# EAGLE design Z80-4chip7 (EAGLE 7.6.0)

## Sheet 1 of 3
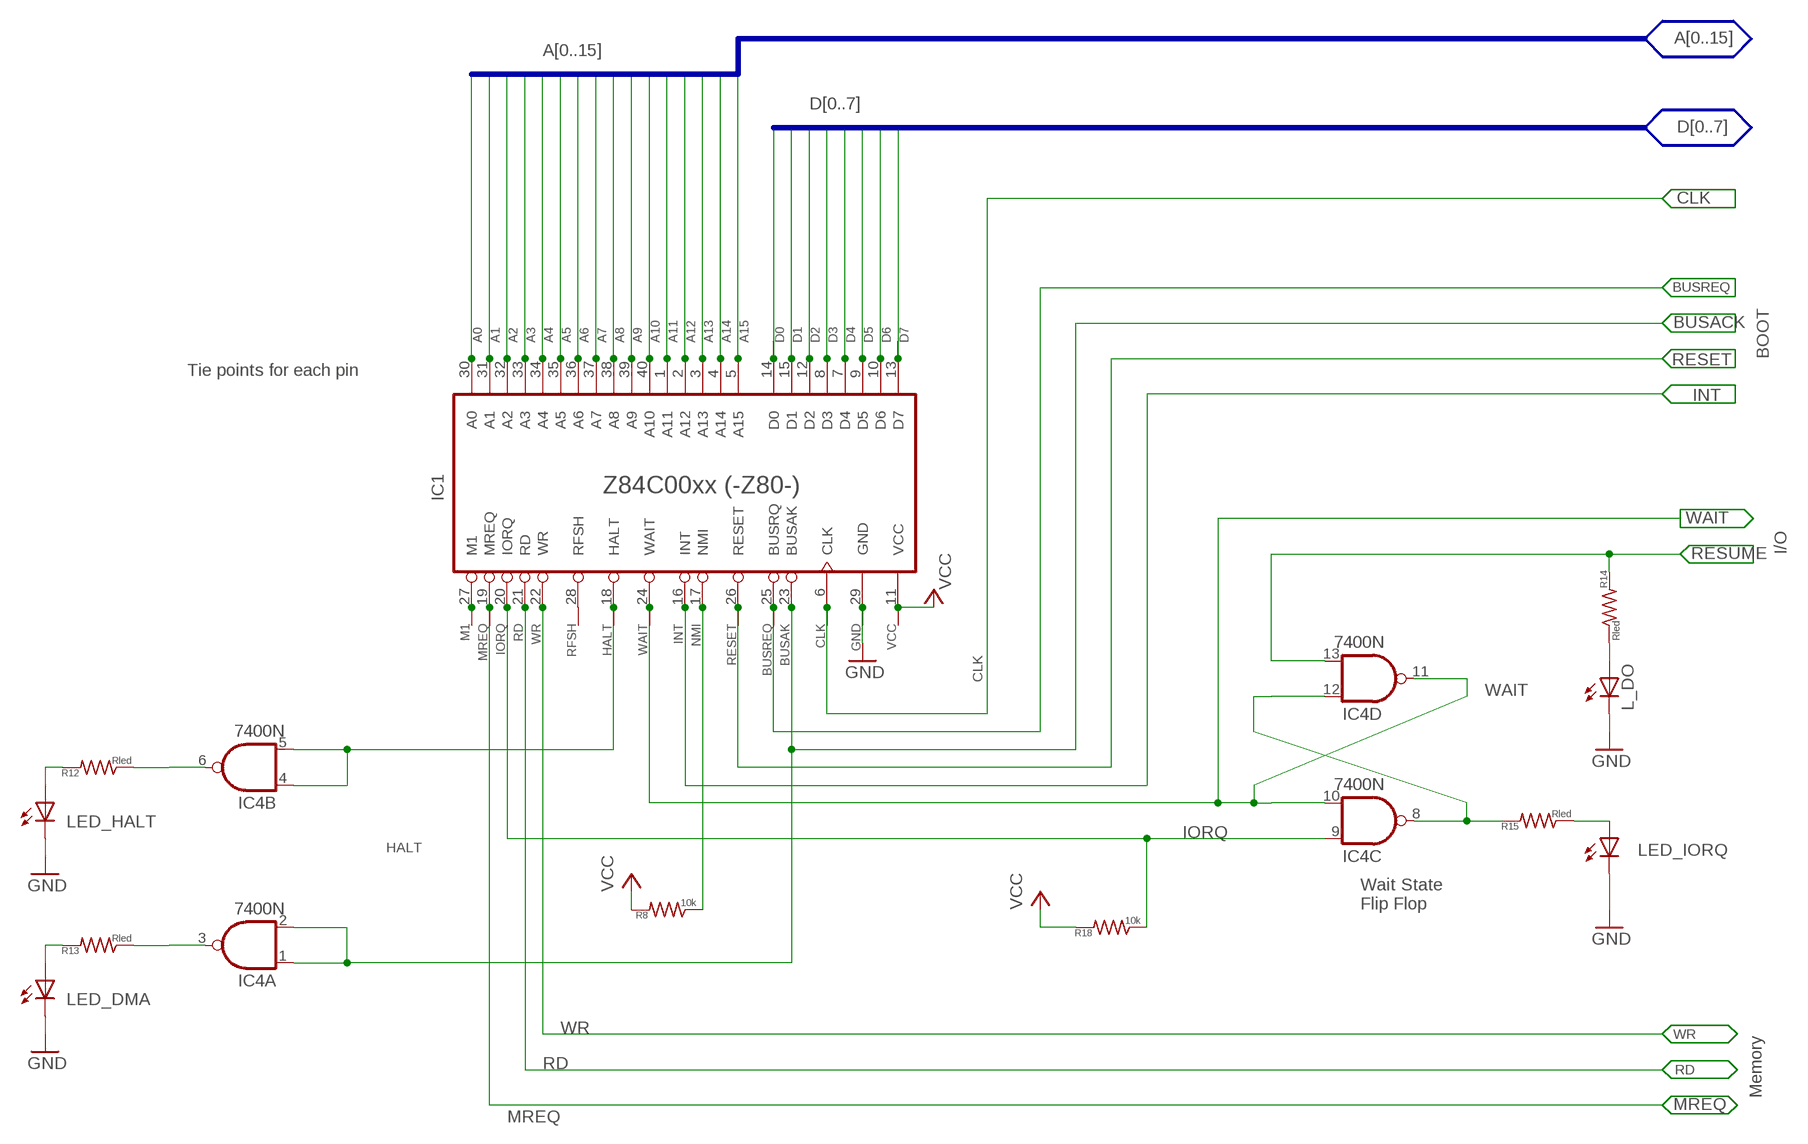
[diagram p0: schematic, sheet 1]

### Parts
A0  WIRE-VIA8  [VIA8]
A1  WIRE-VIA8  [VIA8]
A2  WIRE-VIA8  [VIA8]
A3  WIRE-VIA8  [VIA8]
A4  WIRE-VIA8  [VIA8]
A5  WIRE-VIA8  [VIA8]
A6  WIRE-VIA8  [VIA8]
A7  WIRE-VIA8  [VIA8]
A8  WIRE-VIA8  [VIA8]
A9  WIRE-VIA8  [VIA8]
A10  WIRE-VIA8  [VIA8]
A11  WIRE-VIA8  [VIA8]
A12  WIRE-VIA8  [VIA8]
A13  WIRE-VIA8  [VIA8]
A14  WIRE-VIA8  [VIA8]
A15  WIRE-VIA8  [VIA8]
BUSAK  WIRE-VIA8  [VIA8]
BUSREQ  WIRE-VIA8  [VIA8]
CLK  WIRE-VIA8  [VIA8]
D0  WIRE-VIA8  [VIA8]
D1  WIRE-VIA8  [VIA8]
D2  WIRE-VIA8  [VIA8]
D3  WIRE-VIA8  [VIA8]
D4  WIRE-VIA8  [VIA8]
D5  WIRE-VIA8  [VIA8]
D6  WIRE-VIA8  [VIA8]
D7  WIRE-VIA8  [VIA8]
GND  WIRE-VIA8  [VIA8]
HALT  WIRE-VIA8  [VIA8]
IC1  Z84C00xx (-Z80-)  Z80CPU  [DIL40]
IC4  7400N  [DIL14]
INT  WIRE-VIA8  [VIA8]
IORQ  WIRE-VIA8  [VIA8]
L_DO  LED3MM  [LED3MM]
LED_DMA  LED3MM  [LED3MM]
LED_HALT  LED3MM  [LED3MM]
LED_IORQ  LED3MM  [LED3MM]
M1  WIRE-VIA8  [VIA8]
MREQ  WIRE-VIA8  [VIA8]
NMI  WIRE-VIA8  [VIA8]
R8  10k  R-US_0207/07V  [0204/5]
R12  Rled  R-US_0207/07V  [0204/5]
R13  Rled  R-US_0207/07V  [0204/5]
R14  Rled  R-US_0207/07V  [0204/5]
R15  Rled  R-US_0207/07V  [0204/5]
R18  10k  R-US_0207/07V  [0204/5]
RD  WIRE-VIA8  [VIA8]
RESET  WIRE-VIA8  [VIA8]
RFSH  WIRE-VIA8  [VIA8]
VCC  WIRE-VIA8  [VIA8]
WAIT  WIRE-VIA8  [VIA8]
WR  WIRE-VIA8  [VIA8]

### Nets
A0: A0.P$1 IC1.30(A0) ; also sheet 2
A1: A1.P$1 IC1.31(A1) ; also sheet 2
A2: A2.P$1 IC1.32(A2) ; also sheet 2
A3: A3.P$1 IC1.33(A3) ; also sheet 2
A4: A4.P$1 IC1.34(A4) ; also sheet 2
A5: A5.P$1 IC1.35(A5) ; also sheet 2
A6: A6.P$1 IC1.36(A6) ; also sheet 2
A7: A7.P$1 IC1.37(A7) ; also sheet 2
A8: A8.P$1 IC1.38(A8) ; also sheet 2
A9: A9.P$1 IC1.39(A9) ; also sheet 2
A10: A10.P$1 IC1.40(A10) ; also sheet 2
A11: A11.P$1 IC1.1(A11) ; also sheet 2
A12: A12.P$1 IC1.2(A12) ; also sheet 2
A13: A13.P$1 IC1.3(A13) ; also sheet 2
A14: A14.P$1 IC1.4(A14) ; also sheet 2
A15: A15.P$1 IC1.5(A15) ; also sheet 2
BUSACK: BUSAK.P$1 IC1.23(BUSAK) IC4.1(A:I0) IC4.2(A:I1) ; also sheet 2
BUSREQ: BUSREQ.P$1 IC1.25(BUSRQ) ; also sheet 2
CLK: CLK.P$1 IC1.6(CLK) ; also sheet 2
D0: D0.P$1 IC1.14(D0) ; also sheet 2
D1: D1.P$1 IC1.15(D1) ; also sheet 2
D2: D2.P$1 IC1.12(D2) ; also sheet 2
D3: D3.P$1 IC1.8(D3) ; also sheet 2
D4: D4.P$1 IC1.7(D4) ; also sheet 2
D5: D5.P$1 IC1.9(D5) ; also sheet 2
D6: D6.P$1 IC1.10(D6) ; also sheet 2
D7: D7.P$1 IC1.13(D7) ; also sheet 2
GND [power]: GND.P$1 IC1.29(GND) L_DO.K(C) LED_DMA.K(C) LED_HALT.K(C) LED_IORQ.K(C) ; also sheet 2,3
HALT: HALT.P$1 IC1.18(HALT) IC4.4(B:I0) IC4.5(B:I1)
INT: IC1.16(INT) INT.P$1 ; also sheet 2
IORQ: IC1.20(IORQ) IC4.9(C:I0) IORQ.P$1 R18.1
MREQ: IC1.19(MREQ) MREQ.P$1 ; also sheet 2
N$1: IC1.27(M1) M1.P$1
N$2: IC4.6(B:O) R12.1
N$3: IC4.3(A:O) R13.1
N$5: LED_HALT.A R12.2
N$6: LED_DMA.A R13.2
N$7: L_DO.A R14.1
N$8: LED_IORQ.A R15.1
N$10: IC1.28(RFSH) RFSH.P$1
N$17: IC4.8(C:O) IC4.12(D:I0) R15.2
NMI: IC1.17(NMI) NMI.P$1 R8.1
RD: IC1.21(RD) RD.P$1 ; also sheet 2
RESET: IC1.26(RESET) RESET.P$1 ; also sheet 2
RESUME: IC4.13(D:I1) R14.2 ; also sheet 2
VCC [power]: IC1.11(VCC) R8.2 R18.2 VCC.P$1 ; also sheet 2,3
WAIT: IC1.24(WAIT) IC4.10(C:I1) IC4.11(D:O) WAIT.P$1 ; also sheet 2
WR: IC1.22(WR) WR.P$1 ; also sheet 2

### Buses
A[0..15]
D[0..7]

### Notes on the sheet
- BOOT
- Tie points for each pin
- I/O
- Wait State
  Flip Flop
- Memory

## Sheet 2 of 3
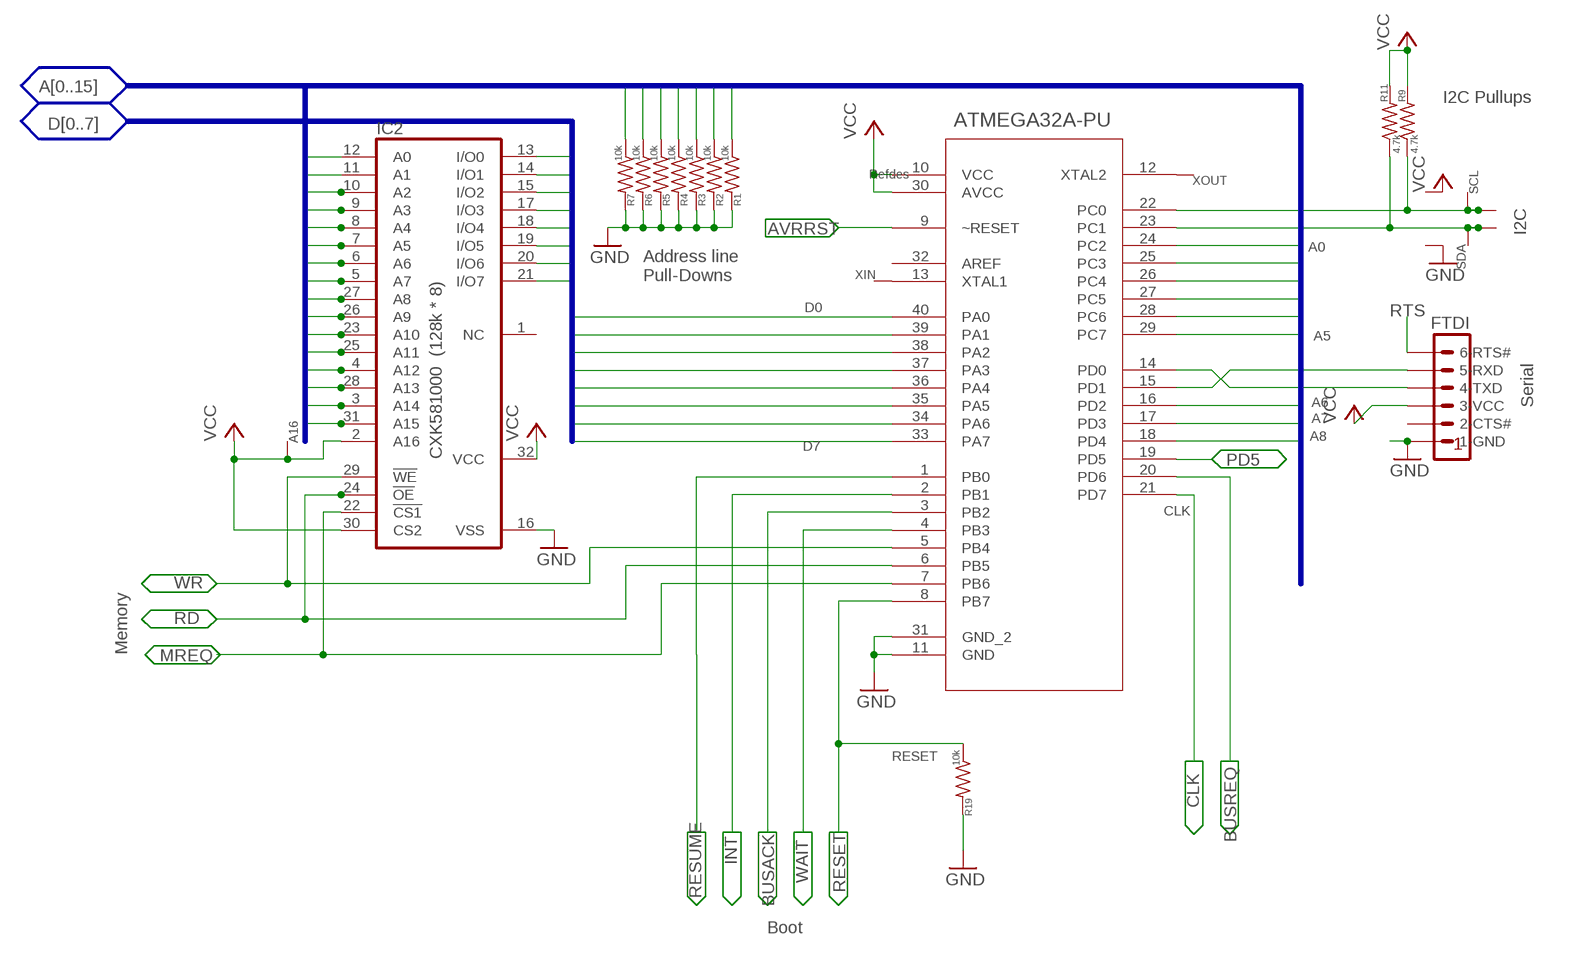
[diagram p1: schematic, sheet 2]

### Parts
A16  WIRE-VIA8  [VIA8]
FTDI  FTDI-TTL232R  [MA06-1]
I2CG  WIRE-R10  [VIA10]
I2CV  WIRE-R10  [VIA10]
IC2  CXK581000 (128k * 8)  MEM128K-PS  [DIL32]
R1  10k  R-US_0207/07V  [0204/5]
R2  10k  R-US_0207/07V  [0204/5]
R3  10k  R-US_0207/07V  [0204/5]
R4  10k  R-US_0207/07V  [0204/5]
R5  10k  R-US_0207/07V  [0204/5]
R6  10k  R-US_0207/07V  [0204/5]
R7  10k  R-US_0207/07V  [0204/5]
R9  4.7k  R-US_0207/07V  [0204/5]
R11  4.7k  R-US_0207/07V  [0204/5]
R19  10k  R-US_0207/07V  [0204/5]
SCL  WIRE-R10  [VIA10]
SDA  WIRE-R10  [VIA10]
U1  ATMEGA32A-PU  [DIP254P1524X482-40]
W1  WIRE-VIA8  [VIA8]
W2  WIRE-VIA8  [VIA8]
XIN  WIRE-VIA8  [VIA8]
XOUT  WIRE-VIA8  [VIA8]

### Nets
A0: IC2.12(A0) U1.24(PC2) ; also sheet 1
A1: IC2.11(A1) U1.25(PC3) ; also sheet 1
A2: IC2.10(A2) U1.26(PC4) ; also sheet 1
A3: IC2.9(A3) U1.27(PC5) ; also sheet 1
A4: IC2.8(A4) U1.28(PC6) ; also sheet 1
A5: IC2.7(A5) U1.29(PC7) ; also sheet 1
A6: IC2.6(A6) U1.16(PD2) ; also sheet 1
A7: IC2.5(A7) U1.17(PD3) ; also sheet 1
A8: IC2.27(A8) U1.18(PD4) ; also sheet 1
A9: IC2.26(A9) R1.1 ; also sheet 1
A10: IC2.23(A10) R2.1 ; also sheet 1
A11: IC2.25(A11) R3.1 ; also sheet 1
A12: IC2.4(A12) R4.1 ; also sheet 1
A13: IC2.28(A13) R5.1 ; also sheet 1
A14: IC2.3(A14) R6.1 ; also sheet 1
A15: IC2.31(A15) R7.1 ; also sheet 1
AVRRST: U1.9(~RESET) ; also sheet 3
BUSACK: U1.3(PB2) ; also sheet 1
BUSREQ: U1.20(PD6) ; also sheet 1
CLK: U1.21(PD7) ; also sheet 1
D0: IC2.13(I/O0) U1.40(PA0) ; also sheet 1
D1: IC2.14(I/O1) U1.39(PA1) ; also sheet 1
D2: IC2.15(I/O2) U1.38(PA2) ; also sheet 1
D3: IC2.17(I/O3) U1.37(PA3) ; also sheet 1
D4: IC2.18(I/O4) U1.36(PA4) ; also sheet 1
D5: IC2.19(I/O5) U1.35(PA5) ; also sheet 1
D6: IC2.20(I/O6) U1.34(PA6) ; also sheet 1
D7: IC2.21(I/O7) U1.33(PA7) ; also sheet 1
GND [power]: FTDI.1(1-GND) I2CG.P$1 IC2.16(VSS) R1.2 R2.2 R3.2 R4.2 R5.2 R6.2 R7.2 R19.2 U1.11(GND) U1.31(GND_2) ; also sheet 1,3
INT: U1.2(PB1) ; also sheet 1
MREQ: IC2.22(!CS1) U1.7(PB6) ; also sheet 1
N$4: FTDI.5(5-RXD) U1.15(PD1)
N$11: FTDI.4(4-TXD) U1.14(PD0)
N$110: U1.13(XTAL1) XIN.P$1
N$111: U1.12(XTAL2) XOUT.P$1
PD5: U1.19(PD5) ; also sheet 3
RD: IC2.24(!OE) U1.6(PB5) ; also sheet 1
RESET: R19.1 U1.8(PB7) ; also sheet 1
RESUME: U1.1(PB0) ; also sheet 1
RTS: FTDI.6(6-RTS#) ; also sheet 3
SCL: R9.1 SCL.P$1 U1.22(PC0) W1.P$1
SDA: R11.1 SDA.P$1 U1.23(PC1) W2.P$1
VCC [power]: A16.P$1 FTDI.3(3-VCC) I2CV.P$1 IC2.2(A16) IC2.30(CS2) IC2.32(VCC) R9.2 R11.2 U1.10(VCC) U1.30(AVCC) ; also sheet 1,3
WAIT: U1.4(PB3) ; also sheet 1
WR: IC2.29(!WE) U1.5(PB4) ; also sheet 1
Unconnected: FTDI.2(2-CTS#) IC2.1(NC) U1.32(AREF)

### Buses
A[0..15]
D[0..7]

### Notes on the sheet
- I2C Pullups
- I2C
- Address line
  Pull-Downs
- Serial
- Memory
- Boot

## Sheet 3 of 3
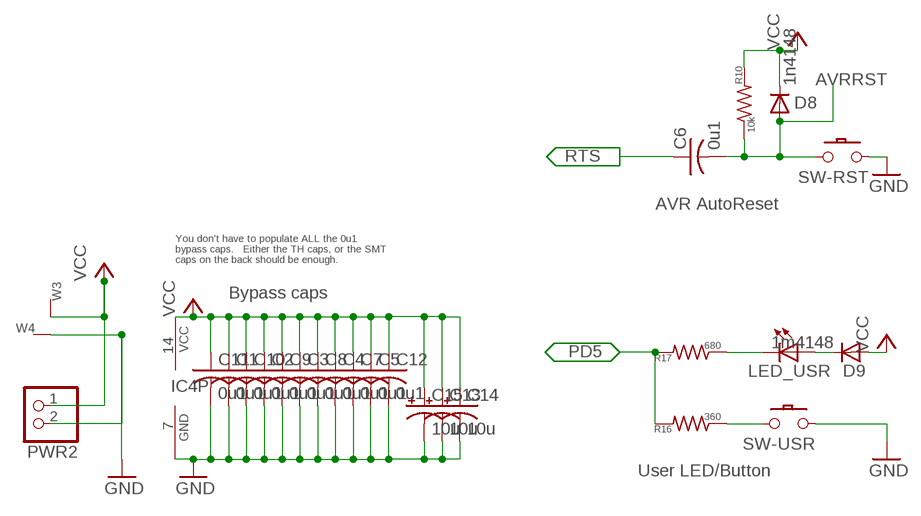
[diagram p2: schematic, sheet 3]

### Parts
C1  0u1  C-US-5MM  [C050-024X044]
C2  0u1  C-US-5MM  [C050-024X044]
C3  0u1  C-US-5MM  [C050-024X044]
C4  0u1  C-US-5MM  [C050-024X044]
C5  0u1  C-US-5MM  [C050-024X044]
C6  0u1  C-US-5MM  [C050-024X044]
C7  0u1  C-US-5MM  [C050-024X044]
C8  0u1  C-USC1206  [C1206]
C9  0u1  C-USC1206  [C1206]
C10  0u1  C-USC1206  [C1206]
C11  0u1  C-USC1206  [C1206]
C12  0u1  C-USC1206  [C1206]
C13  10u  CPOL-USE2.5-6  [E2,5-6]
C14  10u  CPOL-USE2.5-6  [E2,5-6]
C15  10u  CPOL-USE2.5-6  [E2,5-6]
D8  1n4148  DIODE-SIGNAL-5  [DO35-5]
D9  1m4148  DIODE-SIGNAL-5  [DO35-5]
LED_USR  LED3MM  [LED3MM]
PWR2  JST_2PIN-THM  [JST-PH-2-THM]
R10  10k  R-US_0207/07V  [0204/5]
R16  360  R-US_0207/07V  [0204/5]
R17  680  R-US_0207/07V  [0204/5]
SW-RST  SW-PB2/  [SW-PB]
SW-USR  SW-PB2L  [SW-PB]
W3  WIRE-R10  [VIA10]
W4  WIRE-R10  [VIA10]

### Nets
AVRRST: C6.2 D8.A R10.1 SW-RST.3 ; also sheet 2
GND [power]: C1.2 C2.2 C3.2 C4.2 C5.2 C7.2 C8.2 C9.2 C10.2 C11.2 C12.2 C13.- C14.- C15.- IC4.7(P:GND) PWR2.2 SW-RST.2 SW-USR.2 W4.P$1 ; also sheet 1,2
N$15: LED_USR.K(C) R17.1
N$16: D9.C LED_USR.A
N$18: R16.1 SW-USR.4
PD5: R16.2 R17.2 ; also sheet 2
RTS: C6.1 ; also sheet 2
VCC [power]: C1.1 C2.1 C3.1 C4.1 C5.1 C7.1 C8.1 C9.1 C10.1 C11.1 C12.1 C13.+ C14.+ C15.+ D8.C D9.A IC4.14(P:VCC) PWR2.1 R10.2 W3.P$1 ; also sheet 1,2

### Notes on the sheet
- AVR AutoReset
- You don't have to populate ALL the 0u1
  bypass caps.   Either the TH caps, or the SMT
  caps on the back should be enough.
- Bypass caps
- User LED/Button

## Power pins joined to a net without a drawn wire
GND: SW-RST.5(GND) SW-USR.5(GND)

## Library data of the parts
A0 A1-A16 BUSAK BUSREQ CLK D0 D1-D7 GND HALT I2CG I2CV INT IORQ M1 MREQ NMI RD RESET RFSH SCL SDA VCC W1-W4 WAIT WR XIN XOUT = mylib4:WIRE: Pad for a wire offboard
C1-C12 = my-rcl:C-US: CAPACITOR, American symbol
C13-C15 = my-rcl:CPOL-US: POLARIZED CAPACITOR, American symbol
D8 D9 = mylib4:DIODE-SIGNAL
FTDI = mylib4:FTDI-TTL232R: FTDI USB to serial (TTL level) cable
IC1 = zilog:Z80CPU: Z80 FAMILY DEVICE
IC2 = mylib4:MEM128K-PS: MEMORY; OC_FARNELL: unknown; OC_NEWARK: unknown
IC4 = mylib4:74*00: Quad 2-input NAND gate
L_DO LED_DMA LED_HALT LED_IORQ LED_USR = my-led:LED: LED OSRAM: - CHIPLED LG R971, LG N971, LY N971, LG Q971, LY Q971, LO R971, LY R971 LH N974, LH R974 LS Q976, LO Q976, LY Q976 LO Q996 - Hyper CHIPLED LW Q18S LB Q993, LB Q99A, LB R99A - SideLED LS A670, LO A670, LY A670, LG A670, LP A670 LB A673, LV A673, LT A673, LW A673 LH A674 LY A675 LS A676, LA A676, LO A676, LY A676, LW A676 LS A679, LY A679, LG A679 - Hyper Micro SIDELED® LS Y876, LA Y876, LO Y876, LY Y876 LT Y87S - SmartLED LW L88C, LW L88S LB L89C, LB L89S, LG L890 LS L89K, LO L89K, LY L89K LS L896, LA L896, LO L896, LY L896 - TOPLED LS T670, LO T670, LY T670, LG T670, LP T670 LSG T670, LSP T670, LSY T670, LOP T670, LYG T670 LG T671, LOG T671, LSG T671 LB T673, LV T673, LT T673, LW T673 LH T674 LS T676, LA T676, LO T676, LY T676, LB T676, LH T676, LSB T676, LW T676 LB T67C, LV T67C, LT T67C, LS T67K, LO T67K, LY T67K, LW E67C LS E67B, LA E67B, LO E67B, LY E67B, LB E67C, LV E67C, LT E67C LW T67C LS T679, LY T679, LG T679 LS T770, LO T770, LY T770, LG T770, LP T770 LB T773, LV T773, LT T773, LW T773 LH T774 LS E675, LA E675, LY E675, LS T675 LS T776, LA T776, LO T776, LY T776, LB T776 LHGB T686 LT T68C, LB T68C - Hyper Mini TOPLED® LB M676 - Mini TOPLED Santana® LG M470 LS M47K, LO M47K, LY M47K Source: http://www.osram.convergy.de/
PWR2 = adafruit:JST_2PIN: JST 2-Pin Connectors of various flavors SMT-RA (S2B-PH-SM4) 4UConnector #17311 SMT (B2B-PH-SM4) THM-RA (S2B-PH) THM (B2B-PH)
R1-R19 = my-rcl:R-US_: RESISTOR, American symbol
SW-RST = mylib4:SW-PB2
SW-USR = mylib4:SW-PB2; PARTNO: test2
U1 = Atmel_By_element14_Batch_1-00:ATMEGA32A-PU: 8-bit Microcontrollerwith 32K Bytes In-System Programmable Flash; MPN: ATMEGA32A-PU; OC_FARNELL: 1704565; OC_NEWARK: 08R5493; PACKAGE: DIP-40; SUPPLIER: Atmel

## Module CPU
Ports: 

### Library data of the parts

## Net classes
0 default: width 0.3 mm
1 power: width 1 mm, drill 0.6 mm, clearance 0.4 mm

## Board
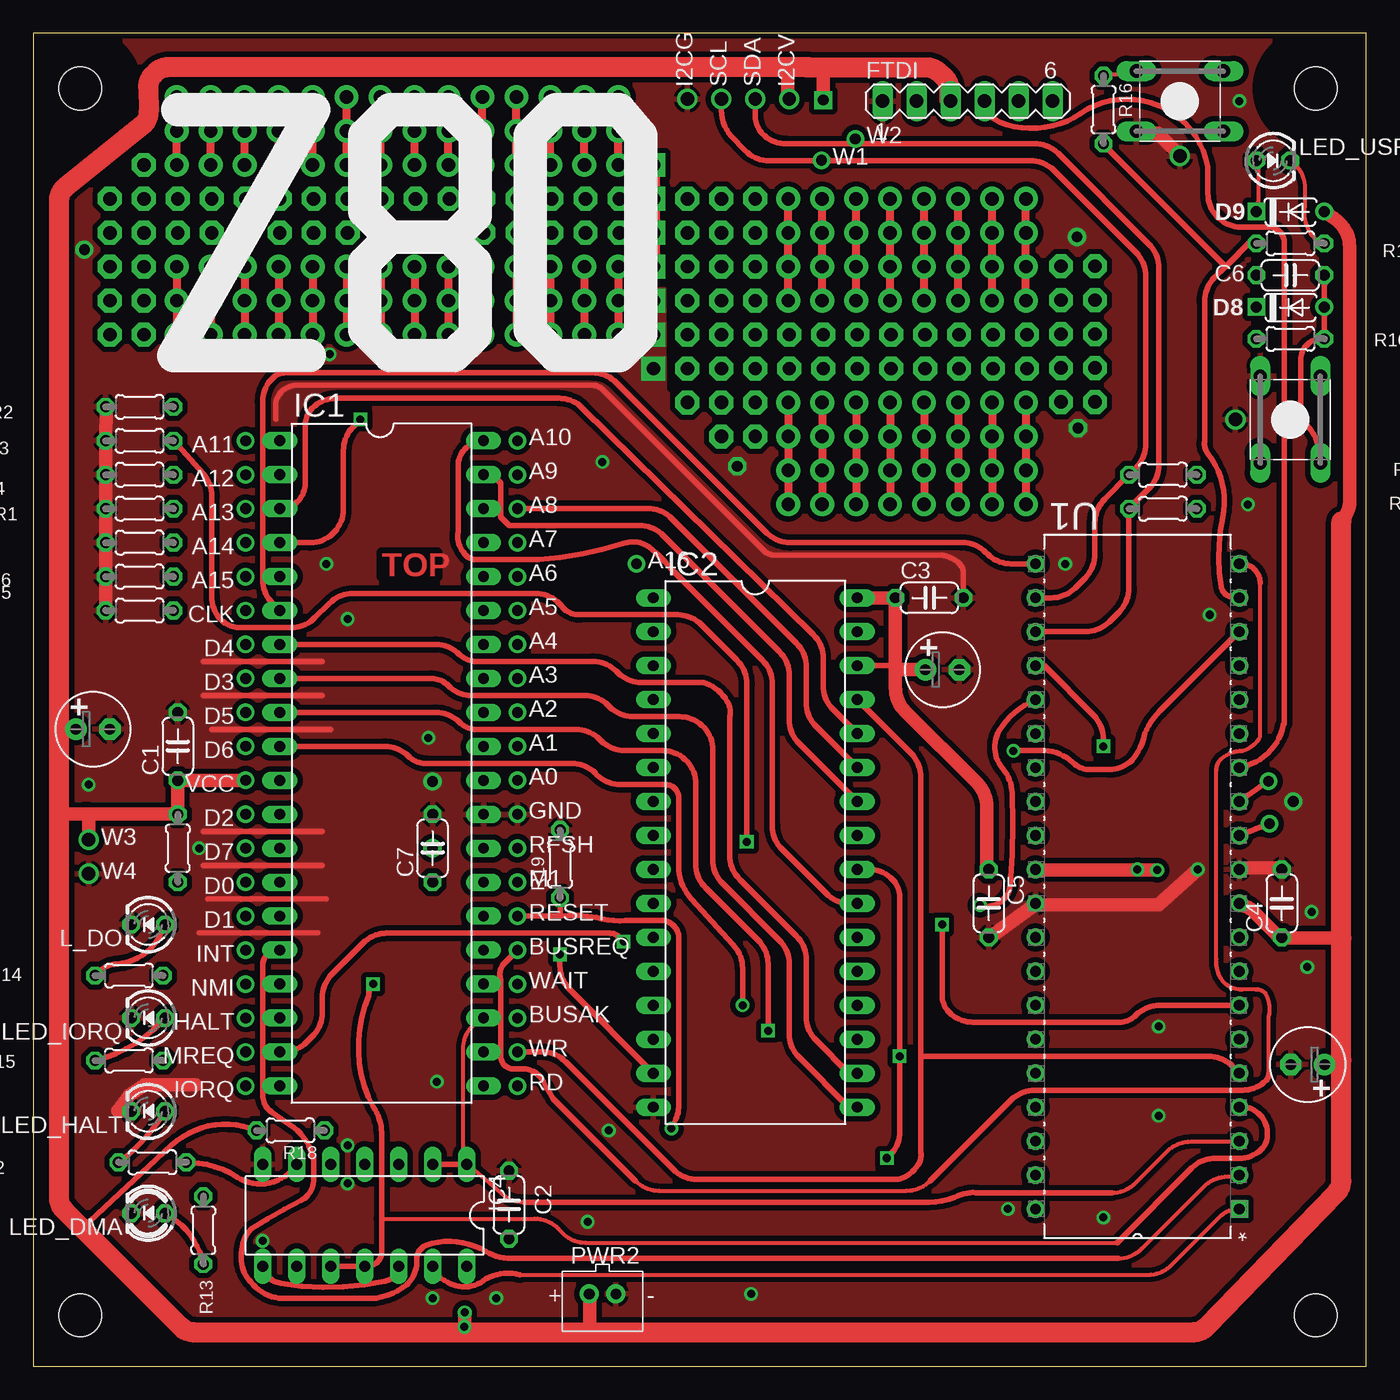
[diagram p3: board, top side]
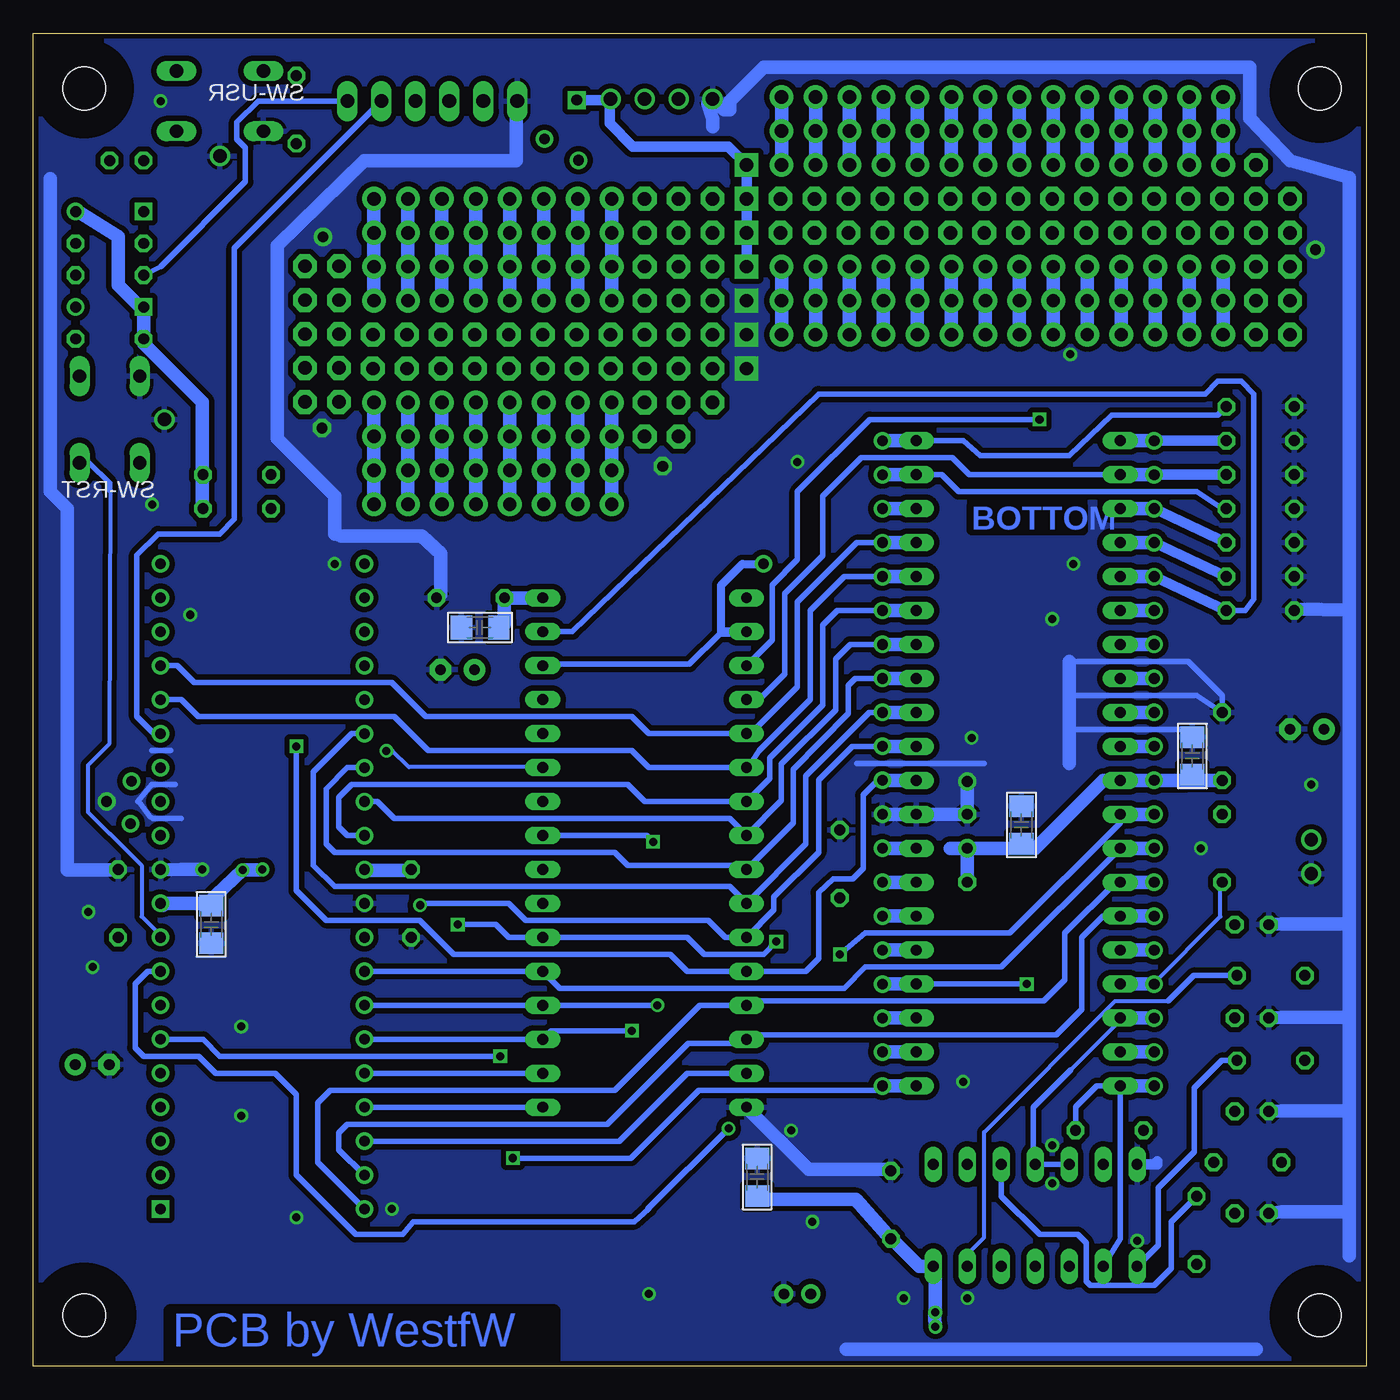
[diagram p4: board, bottom side, seen from below]

Size 99.67 x 99.68 mm. Coordinates in mm from the lower left corner, seen from the top.
Outline: 0,0 99.67,0 99.67,99.68 0,99.68 0,0
Copper layers (1*16): Top 0.035mm / dielectric 1.5mm / Bottom 0.035mm
Design rules "default *": minimum track width 0.3mm, minimum drill 0.4mm, track to track 0.4mm, track to pad 0.3mm, pad to pad 0.3mm, via to via 0.5mm, smd to smd 8mil, copper to edge 10mil, drill to drill 8mil, minimum pad ring 10mil, minimum via ring 8mil, stop-mask expansion 4mil, vias tented up to drill 0.6mm, thermal gap 10mil
Holes 3.2 mm at 3.49,3.81 95.88,3.81 3.49,95.57 95.88,95.57
tRestrict: area 91.8,91.6 to 99.8,99.6; area -0.5,91.6 to 7.5,99.6; 4 lines
bRestrict: area 0.4,92.1 to 6.6,98.4; area 0.3,0.7 to 6.6,7; area 92.6,0.5 to 99.2,7.1; area 92.8,92.4 to 99,98.7; 4 lines

### Footprints (pad centres in the part's own frame; a part is rotated, then mirrored left to right if it is on the bottom)
VIA8 = drill 0.8: P$1 0,0
C050-024X044 = drill 0.813 octagon: 1 -2.54,0; 2 2.54,0
C1206 = smd 1.6 x 1.8: 1 -1.4,0; 2 1.4,0
E2,5-6 = drill 0.813 pad 1.6: + -1.27,0 | drill 0.813 pad 1.6 octagon: - 1.27,0
DO35-5 = drill 0.813: A 2.54,0 | drill 0.813 square: C -2.54,0
MA06-1 = drill 1.016 long: 1 -6.35,0; 2 -3.81,0; 3 -1.27,0; 4 1.27,0; 5 3.81,0; 6 6.35,0
VIA10 = drill 1: P$1 0,0
DIL40 = drill 0.813 long: 1 -24.13,-7.62; 2 -21.59,-7.62; 3 -19.05,-7.62; 4 -16.51,-7.62; 5 -13.97,-7.62; 6 -11.43,-7.62; 7 -8.89,-7.62; 8 -6.35,-7.62; 9 -3.81,-7.62; 10 -1.27,-7.62; 11 1.27,-7.62; 12 3.81,-7.62; 13 6.35,-7.62; 14 8.89,-7.62; 15 11.43,-7.62; 16 13.97,-7.62; 17 16.51,-7.62; 18 19.05,-7.62; 19 21.59,-7.62; 20 24.13,-7.62; 21 24.13,7.62; 22 21.59,7.62; 23 19.05,7.62; 24 16.51,7.62; 25 13.97,7.62; 26 11.43,7.62; 27 8.89,7.62; 28 6.35,7.62; 29 3.81,7.62; 30 1.27,7.62; 31 -1.27,7.62; 32 -3.81,7.62; 33 -6.35,7.62; 34 -8.89,7.62; 35 -11.43,7.62; 36 -13.97,7.62; 37 -16.51,7.62; 38 -19.05,7.62; 39 -21.59,7.62; 40 -24.13,7.62
DIL32 = drill 0.813 long: 1 -19.05,-7.62; 2 -16.51,-7.62; 3 -13.97,-7.62; 4 -11.43,-7.62; 5 -8.89,-7.62; 6 -6.35,-7.62; 7 -3.81,-7.62; 8 -1.27,-7.62; 9 1.27,-7.62; 10 3.81,-7.62; 11 6.35,-7.62; 12 8.89,-7.62; 13 11.43,-7.62; 14 13.97,-7.62; 15 16.51,-7.62; 16 19.05,-7.62; 17 19.05,7.62; 18 16.51,7.62; 19 13.97,7.62; 20 11.43,7.62; 21 8.89,7.62; 22 6.35,7.62; 23 3.81,7.62; 24 1.27,7.62; 25 -1.27,7.62; 26 -3.81,7.62; 27 -6.35,7.62; 28 -8.89,7.62; 29 -11.43,7.62; 30 -13.97,7.62; 31 -16.51,7.62; 32 -19.05,7.62
DIL14 = drill 0.813 long: 1 -7.62,-3.81; 2 -5.08,-3.81; 3 -2.54,-3.81; 4 0,-3.81; 5 2.54,-3.81; 6 5.08,-3.81; 7 7.62,-3.81; 8 7.62,3.81; 9 5.08,3.81; 10 2.54,3.81; 11 0,3.81; 12 -2.54,3.81; 13 -5.08,3.81; 14 -7.62,3.81
LED3MM = drill 0.813 octagon: A -1.27,0; K 1.27,0
JST-PH-2-THM = drill 0.8 pad 1.422: 1 1,0; 2 -1,0
0204/5 = drill 0.813 octagon: 1 -2.54,0; 2 2.54,0
SW-PB = drill 1 long: 1 3.25,-2.25; 2 -3.25,-2.25; 3 3.25,2.25; 4 -3.25,2.25 | drill 1: 5 0,-4.1
DIP254P1524X482-40 = drill 0.8 square: 1 -15.24,48.26 | drill 0.8: 2 -15.24,45.72; 3 -15.24,43.18; 4 -15.24,40.64; 5 -15.24,38.1; 6 -15.24,35.56; 7 -15.24,33.02; 8 -15.24,30.48; 9 -15.24,27.94; 10 -15.24,25.4; 11 -15.24,22.86; 12 -15.24,20.32; 13 -15.24,17.78; 14 -15.24,15.24; 15 -15.24,12.7; 16 -15.24,10.16; 17 -15.24,7.62; 18 -15.24,5.08; 19 -15.24,2.54; 20 -15.24,0; 21 0,0; 22 0,2.54; 23 0,5.08; 24 0,7.62; 25 0,10.16; 26 0,12.7; 27 0,15.24; 28 0,17.78; 29 0,20.32; 30 0,22.86; 31 0,25.4; 32 0,27.94; 33 0,30.48; 34 0,33.02; 35 0,35.56; 36 0,38.1; 37 0,40.64; 38 0,43.18; 39 0,45.72; 40 0,48.26

### Placement (x,y rotation side)
A0  36.2,43.81 0 top
A1  36.2,46.35 0 top
A2  36.2,48.9 0 top
A3  36.2,51.44 0 top
A4  36.2,53.98 0 top
A5  36.2,56.52 0 top
A6  36.2,59.05 0 top
A7  36.2,61.59 0 top
A8  36.2,64.14 0 top
A9  36.2,66.67 0 top
A10  36.2,69.22 0 top
A11  15.88,69.22 180 top
A12  15.88,66.67 180 top
A13  15.88,64.14 180 top
A14  15.88,61.59 180 top
A15  15.88,59.05 180 top
A16  45.09,60.01 0 top
BUSAK  36.2,26.04 0 top
BUSREQ  36.2,31.11 0 top
C1  10.79,46.35 90 top
C2  35.56,12.06 90 top
C3  66.99,57.47 0 top
C4  93.35,34.61 90 top
C5  71.44,34.61 270 top
C6  93.98,81.6 0 top
C7  29.84,38.73 90 top
C8  66.28,55.24 180 bottom
C9  13.02,45.64 90 bottom
C10  25.8,40.48 90 bottom
C11  45.56,14.13 90 bottom
C12  86.39,33.03 270 bottom
C13  95.28,22.55 180 top
C14  4.45,47.64 0 top
C15  67.97,52.09 0 top
CLK  15.88,56.52 180 top
D0  15.88,36.2 180 top
D1  15.88,33.66 180 top
D2  15.88,41.27 180 top
D3  15.88,51.44 180 top
D4  15.88,53.98 180 top
D5  15.88,48.9 180 top
D6  15.88,46.35 180 top
D7  15.88,38.73 180 top
D8  93.98,79.22 0 top
D9  93.98,86.36 0 top
FTDI  69.85,94.61 0 top
GND  36.2,41.27 0 top
HALT  15.88,26.04 180 top
I2CG  48.9,94.77 90 top
I2CV  56.52,94.77 90 top
IC1  26.04,45.09 270 top
IC2  53.98,38.42 270 top
IC4  24.77,11.27 180 top
INT  15.88,31.11 180 top
IORQ  15.88,20.95 180 top
L_DO  8.57,33.02 180 top
LED_DMA  8.57,11.43 180 top
LED_HALT  8.57,19.05 180 top
LED_IORQ  8.57,26.04 180 top
LED_USR  92.71,90.17 0 top
M1  36.2,36.2 0 top
MREQ  15.88,23.5 180 top
NMI  15.88,28.57 180 top
PWR2  42.56,5.4 180 top
R1  7.94,64.14 180 top
R2  7.94,71.75 180 top
R3  7.94,69.22 180 top
R4  7.94,66.67 180 top
R5  7.94,61.59 180 top
R6  7.94,59.05 180 top
R7  7.94,56.52 180 top
R8  10.79,38.73 90 top
R9  84.45,66.67 0 top
R10  93.98,76.83 180 top
R11  84.45,64.14 0 top
R12  8.89,15.24 180 top
R13  12.7,10.16 270 top
R14  7.14,29.21 0 top
R15  7.14,22.86 0 top
R16  80.01,93.98 270 top
R17  93.98,83.98 180 top
R18  19.22,17.63 180 top
R19  39.38,37.56 90 top
RD  36.2,20.95 0 top
RESET  36.2,33.66 0 top
RFSH  36.2,38.73 0 top
SCL  51.44,94.77 90 top
SDA  53.98,94.77 90 top
SW-RST  93.98,70.8 270 top
SW-USR  85.72,94.61 0 top
U1  74.93,60.01 180 top
VCC  15.88,43.81 180 top
W1  58.92,90.2 0 top
W2  61.46,91.79 0 top
W3  4.13,39.37 0 top
W4  4.13,36.83 0 top
WAIT  36.2,28.57 0 top
WR  36.2,23.5 0 top
XIN  92.34,43.75 0 top
XOUT  92.42,40.57 0 top

### Tracks (layer width: path | path; a pad name or v marks a point on that pad's centre or on a via)
A0  (via drill 0.6)
  Top 0.4: U1.24 75.56,52.39 79.28,48.67 arc-45 80.01,46.91 v80.01,46.35
  Bottom 0.4: v80.01,46.35 80.01,35.56 77.79,33.34 70.8,33.34 68.26,30.8 52.07,30.8 50.8,29.53 IC2.12 41.93,29.53 40.97,30.49 40.97,35.41 39.86,36.45 38.43,36.45 37.64,37.24 37.64,42.72 37.48,42.88 36.54,43.81 A0.P$1
  Bottom 1: IC1.30 A0.P$1
A1  (via drill 0.6)
  Top 0.4: U1.25 74.45,49.61 arc33 72.23,47.55 arc71 72.47,44.69 arc-38 73.18,42.86 arc-7 73.02,35.96 arc-103 v70.77,34.48
  Bottom 0.4: v70.77,34.48 70.63,34.61 64.13,34.61 62.87,33.34 49.21,33.34 47.94,32.07 IC2.11 44.31,34.12 44.31,35.09 40.97,38.43 40.97,43.83 38.45,46.35 A1.P$1
  Bottom 1: A1.P$1 IC1.31
A2
  Bottom 0.4: U1.26 75.88,47.31 78.74,44.45 78.74,37.47 77.15,35.88 47.62,35.88 IC2.10 41.92,39.04 41.92,44.15 37.18,48.9 A2.P$1
  Bottom 1: IC1.32 A2.P$1
A3
  Bottom 0.4: U1.27 76.2,44.77 77.79,43.18 77.79,39.05 77.15,38.42 56.2,38.42 55.25,37.47 46.67,37.47 IC2.9 42.88,40.63 42.88,44.62 38.75,48.83 38.75,50.9 38.21,51.44 A3.P$1
  Bottom 1: IC1.33 A3.P$1
A4
  Bottom 0.4: U1.28 73.98,42.23 72.71,40.96 47.62,40.96 IC2.8 43.75,42.29 43.75,45.02 39.7,49.07 39.7,52.88 38.61,53.98 A4.P$1
  Bottom 1: IC1.34 A4.P$1
A5
  Bottom 0.4: U1.29 76.2,39.69 76.83,40.32 76.83,42.55 75.88,43.5 55.25,43.5 53.98,42.23 46.99,42.23 46.67,41.91 IC2.7 44.62,43.96 44.62,45.5 40.65,49.47 40.65,55.42 39.56,56.52 A5.P$1
  Bottom 1: IC1.35 A5.P$1
A6
  Bottom 0.4: A6.P$1 39.05,59.05 41.59,56.52 41.59,49.85 45.4,46.04 46.04,45.09 IC2.6 53.66,44.77 54.93,46.04 70.17,46.04 72.71,48.58 87.34,48.58 88.61,49.85 U1.16
  Bottom 1: IC1.36 A6.P$1
A7
  Bottom 0.4: A7.P$1 38.1,61.59 42.55,57.15 42.55,50.8 46.04,47.31 IC2.5 53.66,47.31 54.93,48.58 70.33,48.58 72.87,51.12 87.66,51.12 88.93,52.39 U1.17
  Bottom 1: IC1.37 A7.P$1
A8  (via drill 0.6)
  Top 0.4: IC2.27 58.52,47.84 arc-45 57.79,49.61 57.79,52.3 arc45 57.05,54.07 47.72,63.4 arc45 45.95,64.14 A8.P$1 | U1.18 84.23,48.99 arc27 83.11,47.31 arc-28 82.17,45.34 arc-45 80.4,44.61 79.02,44.61 arc-45 77.73,45.15 arc45 75.32,46.04 73.29,46.04 v73.28,46.02
  Bottom 0.3: v73.28,46.02 72.83,46.02 71.61,44.8 61.66,44.8 IC2.27
  Bottom 1: IC1.38 A8.P$1
A9
  Top 0.4: IC2.26 57.25,46.58 arc-45 56.52,48.34 56.52,51.67 arc45 55.78,53.44 47.09,62.13 arc45 45.32,62.87 35.56,62.87 34.93,63.5 34.93,66.04 34.29,66.67 IC1.39
  Bottom 0.4: IC1.39 31.75,66.67 30.48,65.41 12.7,65.41 10.79,64.14 | 10.79,64.45 10.79,64.14 | 10.79,64.14 R1.1
  Bottom 1: A9.P$1 IC1.39
A10
  Top 0.4: IC2.23 61.04,34.61 arc-45 59.27,35.34 55.98,38.64 arc-45 55.25,40.41 55.25,51.03 arc45 54.51,52.8 47.72,59.59 arc10 46.04,61.28 arc54 44.05,61.52 arc-13 37.78,60.33 33.02,60.33 arc-56 32.15,60.88 arc-45 31.75,62.41 31.75,67.31 arc-90 IC1.40
  Bottom 0.4: IC1.40 30.16,69.22 28.89,68.1 22.22,68.1 19.05,71.12 11.11,71.12 R2.1
  Bottom 1: IC1.40 A10.P$1
A11  (via drill 0.6)
  Top 0.4: v53.34,39.21 53.34,51.03 arc45 52.61,52.8 49.95,55.47 arc45 48.18,56.2 40.84,56.2 arc-51 39.49,56.85 arc51 37.53,57.78 23.9,57.78 arc45 22.13,57.05 21.05,55.98 arc-45 19.28,55.24 15.37,55.24 arc-45 14.07,55.78 arc-45 13.34,57.55 13.34,65.08 arc42 12.69,66.75 R3.1
  Bottom 0.4: IC2.25 53.82,39.69 v53.34,39.21
  Bottom 0.8: R3.1 A11.P$1
  Bottom 1: A11.P$1 IC1.1
A12
  Bottom 0.4: IC2.4 45.4,49.85 43.5,51.75 43.5,57.78 40.64,60.64 40.64,65.09 37.78,67.94 30.96,67.94 29.69,66.67 IC1.2
  Bottom 0.8: A12.P$1 R4.1
  Bottom 1: IC1.2 A12.P$1
A13
  Top 0.4: IC2.28 59.79,49.12 arc-45 59.05,50.88 59.05,52.93 arc45 58.31,54.71 41.05,71.67 arc45 39.3,72.39 22.63,72.39 arc45 20.86,71.66 arc45 20.32,70.36 20.32,66.04 arc-90 IC1.3
  Bottom 0.8: A13.P$1 R5.1
  Bottom 1: A13.P$1 IC1.3
A14  (via drill 0.6)
  Top 0.4: v24.45,70.8 23.91,70.27 arc45 23.18,68.5 23.18,64.09 arc-90 20.68,61.59 IC1.4
  Bottom 0.4: IC2.3 44.45,54.29 44.45,58.42 42.55,60.33 42.55,65.41 37.15,70.8 v24.45,70.8
  Bottom 0.8: A14.P$1 R6.1
  Bottom 1: IC1.4 A14.P$1
A15
  Bottom 0.4: IC2.31 59.37,54.93 40.96,72.71 12.06,72.71 11.11,73.66 9.37,73.66 8.41,72.71 8.41,57.39 9.05,56.52 R7.1
  Bottom 0.8: R7.1 A15.P$1
  Bottom 1: A15.P$1 IC1.5
AVRRST
  Top 0.4: C6.2 D8.A R10.1 96.01,76.8 arc90 95.99,76.78 arc81 94.77,75.31 arc-1 94.77,71.9 arc40 95.36,70.23 arc-36 96.19,68.13 SW-RST.3
  Bottom 0.3: 93.94,65.5 94.01,46.53 95.6,44.94 95.6,41.45 93.96,39.8 93.94,39.8 91.59,37.45 91.59,33.63 90.19,32.23 90.19,32.2 U1.9
  Bottom 0.4: SW-RST.3 95.49,67.55 93.98,66.04 93.98,65.53 93.94,65.5
BUSACK
  Top 0.3: 80.63,12.95 arc45 82.4,13.68 84.78,16.07 arc-45 86.55,16.8 90.02,16.8 U1.3 | 32.42,15.12 34.85,13.04 arc46 36.66,12.27 | 32.12,15.29 32.12,23.7 arc-52 33.1,25.68 33.49,25.98 33.49,25.9 IC1.23
  Top 0.4: 80.63,12.95 70.71,12.95 arc38 68.9,12.62 arc-24 66.52,12.27 36.66,12.27 | IC4.2 IC4.1 | 32.12,15.29 arc106 IC4.1 | IC4.1 IC4.1 arc90 32.42,15.12
  Bottom 1: BUSAK.P$1 IC1.23
BUSREQ
  Top 0.3: 91.73,58.56 91.73,47.06 arc-45 90.39,46.02 arc40 88.86,45.47 arc50 88.46,44.58 88.46,30.44 arc45 89.03,28.67 arc45 90.38,28.18 91.42,28.18 arc-45 92.11,27.89 arc-45 92.37,26.12 92.37,21.84 | 45.01,13.86 arc45 46.78,13.12 65.29,13.12 arc45 67.06,13.86
  Top 0.4: 45.01,13.86 38.86,20 arc-3 38.11,21.28 arc67 36.52,22.23 35.89,22.23 arc-90 34.94,23.18 34.94,28.9 arc-62 35.25,30.17 arc0 35.89,30.81 BUSREQ.P$1 | 67.06,13.86 73.1,19.91 arc-45 74.87,20.64 90.41,20.64 arc45 92.17,21.37 arc45 92.37,21.84 | 91.73,58.56 arc90 90.28,60.01 U1.20
  Bottom 0.3: 90.19,60.01 U1.20
  Bottom 1: BUSREQ.P$1 IC1.25
CLK
  Top 0.4: IC1.6 17.88,57.05 arc-45 17.14,58.82 17.14,72.15 arc-45 17.88,73.92 arc-45 18.79,74.3 41.83,74.3 arc-45 43.59,73.56 54.83,62.33 arc45 56.6,61.59 69.45,61.59 arc-45 71.22,60.86 71.34,60.74 arc45 73.11,60.01 U1.21
  Bottom 1: IC1.6 CLK.P$1
D0
  Bottom 0.4: IC1.14 18.73,36.2 22.54,32.38 22.54,28.89 24.13,27.3 46.04,27.3 IC2.13 49.85,26.99 56.2,20.64 77.47,20.64 78.42,19.68 78.42,15.24 U1.40
  Bottom 1: IC1.14 D0.P$1
D1
  Bottom 0.4: U1.39 76.83,16.19 76.83,17.46 76.2,18.1 56.75,18.1 50.72,24.13 46.67,24.13 IC2.14 46.04,24.77 23.18,24.77 21.27,26.67 21.27,32.07 19.68,33.66 IC1.15
  Bottom 1: D1.P$1 IC1.15
D2  (via drill 0.6)
  Top 0.4: v39.37,30.8 39.37,29.93 arc45 40.1,28.16 IC2.15
  Bottom 0.4: U1.38 55.88,16.83 50.8,21.91 IC2.15 | IC1.12 18.41,40.64 26.67,32.38 37.47,32.38 v39.37,30.8
  Bottom 1: D2.P$1 IC1.12
D3
  Top 0.4: IC1.8 29.72,51.44 arc-45 31.02,50.9 arc45 32.79,50.16 41.19,50.16 arc-45 42.96,49.43 43.08,49.31 arc45 44.85,48.58 48.3,48.58 arc-90 50.8,46.08 50.8,37.87 arc45 51.53,36.1 55.78,31.85 arc-45 56.52,30.08 56.52,24.85 arc45 57.25,23.08 60.96,19.37 IC2.17
  Bottom 0.4: U1.37 IC2.17
  Bottom 1: IC1.8 D3.P$1
D4
  Top 0.4: IC1.7 30.08,53.98 arc-45 31.85,53.24 arc45 33.15,52.7 41.83,52.7 arc-45 43.59,51.97 43.72,51.85 arc45 45.49,51.12 50.08,51.12 arc-45 51.85,49.75 arc-45 52.07,48.58 52.07,38.18 arc45 52.8,36.41 57.05,32.16 arc-45 57.79,30.4 57.79,26.12 arc45 58.52,24.35 60.96,21.91 IC2.18
  Bottom 0.4: IC2.18 U1.36
  Bottom 1: D4.P$1 IC1.7
D5  (via drill 0.6)
  Top 0.4: IC1.9 30.08,48.9 arc-45 31.85,48.16 arc45 33.15,47.62 40.56,47.62 arc-45 42.33,46.89 42.45,46.77 arc45 44.22,46.04 47.03,46.04 arc-90 49.53,43.54 49.53,37.55 arc45 50.26,35.78 54.2,31.85 arc-45 54.93,30.08 v54.93,25.08
  Bottom 0.4: U1.35 IC2.19 60.96,25.08 v54.93,25.08
  Bottom 1: D5.P$1 IC1.9
D6  (via drill 0.6)
  Top 0.4: IC1.10 26.27,46.35 arc-45 28.04,45.62 arc45 29.34,45.09 40.24,45.09 arc-45 42.01,44.35 42.13,44.23 arc45 43.9,43.5 47.26,43.5 arc-90 48.26,42.5 48.26,37.39 arc45 49.23,34.91 52.29,31.53 arc-45 53.02,29.76 v53.02,26.99
  Bottom 0.4: U1.34 IC2.20 v53.02,26.99
  Bottom 1: IC1.10 D6.P$1
D7
  Bottom 0.4: U1.33 IC2.21 60.33,28.26 39.05,28.26 37.47,29.84 27.3,29.84 IC1.13
  Bottom 1: D7.P$1 IC1.13
GND  (via drill 0.6, 0.8, 1 pad 1.78)
  Top 0.4: 12.7,52.7 21.59,52.7 | 12.7,50.16 21.59,50.16 | 13.34,47.62 22.22,47.62 | 12.7,40.01 21.59,40.01 | 12.7,37.47 21.59,37.47 | 13.02,34.92 21.91,34.92 | 12.38,32.38 21.27,32.38 | C3.2 69.53,59.31 arc45 69.24,60.03 arc45 67.7,60.66 55.39,60.66 arc-45 54.63,60.98 | 54.63,60.98 arc63 54.63,60.98 | 54.63,60.98 42.56,73.05 arc45 41.79,73.37 19.69,73.37 arc90 18.1,71.78 18.1,70.83
  Top 1: SW-USR.2 82.49,92.22 84.06,92.22 85.64,90.65 SW-USR.5 | C5.2 71.5,32.08 74.89,34.52 74.79,34.48 U1.31 75.47,34.51 84.1,34.51 v87.06,37.15 | U1.11 90.19,37.27 93.31,37.27 C4.2 | 12.14,21.02 8.43,21.02 arc45 8.26,21 7.22,20.29 6.32,19.07 LED_HALT.K | 5.43,71.64 R3.2 arc2 R4.2 arc-2 R1.2 arc2 R5.2 arc-2 R6.2 arc2 R7.2
  Bottom 0.4: 22.22,52.7 13.34,52.7 10.79,50.16 C1.2 12.7,50.16 22.22,50.16 | 22.22,47.62 12.7,47.62 | 38.11,45.08 28.58,45.08 | 89.09,43.51 90.83,43.51 91.87,42.24 91.79,42.24 90.99,41.13 90.75,40.97 88.61,40.97 | 89.41,46.05 90.83,46.05
  Bottom 0.8: IC4.7 15.64,15.09 15.64,15.32
  Bottom 1: GND.P$1 IC1.29 C7.2 29.84,43.81 | 35.59,14.51 C2.2 35.94,14.7 41.72,14.7 46.27,19.25 IC2.16 | 1.27,56.57 1.27,88.9 5.71,90.17 8.73,93.34 8.73,97.16 45.09,97.16 47.62,94.61 47.62,93.98 48.02,93.97 I2CG.P$1 49.24,94.42 48.9,93.28 48.9,92.71 | 1.27,56.57 1.27,33.08 | 1.27,33.08 1.27,26.07 | 1.27,26.07 1.27,19.07 | 1.27,19.07 1.27,11.55 | 1.27,11.55 1.27,8.26 | 8.26,1.27 38.91,1.27 | 98.42,88.81 98.42,65.41 97.16,64.14 97.16,37.1 93.16,37.1 C4.2 | 1.27,11.55 6.32,11.55 LED_DMA.K | 1.27,19.07 6.32,19.07 LED_HALT.K | 1.27,26.07 6.32,26.07 LED_IORQ.K | 1.27,33.08 6.32,33.08 L_DO.K | 10.74,49 C1.2 | C3.2 69.21,57.73 69.21,60.8 70.64,62.07 76.68,62.07 77.15,62.23 77.15,65.09 81.44,69.37 81.44,83.82 74.93,90.17 63.59,90.17 63.59,94.5 FTDI.1 | v87.06,37.15 88.63,37.15 90.02,37.1 U1.11 | 1.27,56.57 5.33,56.61 R7.2 | 85.81,90.47 SW-USR.5 | 22.22,45.09 22.22,47.62 22.22,50.16 22.22,52.7
  other vias: 29.53,46.99 21.91,60.01 23.49,55.88 52.63,67.31 78.1,70.17 78.03,84.45 87.95,56.2 95.25,29.84 53.66,5.4 90.8,64.45 77.15,60.01 22.15,75.68 84.14,18.73 84.14,25.4 80.01,11.11 30.16,21.27 4.13,43.5 29.84,5.08 34.61,5.08 3.81,83.5 42.55,67.63 95.57,33.97 41.43,10.79 43.02,17.62 72.87,11.75 29.84,43.74 12.39,38.73 90.17,94.63 17.14,9.37 23.49,13.66 23.49,16.51 94.2,42.23 46.36,79.69 46.36,77.15 46.36,74.61
  pour Bottom (isolate 0.4): -3.81,100.97 102.23,100.97 102.55,-0.95 -3.49,-0.95 -3.49,100.01
  pour Top (isolate 0.4): -3.17,100.65 -3.17,-0.95 106.36,-0.95 106.36,100.65
HALT
  Bottom 0.3: 22.11,22.16 18.61,25.66 18.61,25.73 IC1.18
  Bottom 0.4: 22.11,22.16 24.93,19.34 24.93,16.03 24.93,15.24 arc-90 IC4.4 IC4.5
  Bottom 1: IC1.18 HALT.P$1
INT
  Top 0.3: 81.1,8.05 arc45 82.87,8.78 87.53,13.44 arc-45 89.3,14.18 90.02,14.18 U1.2
  Top 0.4: 81.1,8.05 35.75,8.05 arc-31 33.83,8.57 arc49 29.38,9.05 arc72 28.67,7.96 arc-45 28.02,6.19 27.93,6.09 arc-28 25.64,5.08 18.34,5.08 arc-45 16.25,6.29 16.13,6.41 arc-45 15.56,8.34 15.56,8.49 arc-45 16.29,10.26 arc-4 20.01,12.39 arc63 20.96,13.97 arc0 20.95,15.48 20.95,15.45 arc45 19.17,18.06 17.9,18.94 arc-59 17.14,20.28 17.14,29.95 arc-45 17.52,30.85 arc-45 18.15,31.11 IC1.16
  Bottom 1: IC1.16 INT.P$1
IORQ
  Bottom 0.4: R18.1 21.75,19.38 20.17,20.96 IC1.20 18.41,9.53 IC4.9
  Bottom 1: IC1.20 IORQ.P$1
MREQ  (via drill 0.6)
  Top 0.4: IC1.19 18.65,23.5 arc45 20.42,24.23 20.86,24.67 arc45 21.59,26.44 21.59,27.54 arc-45 22.32,29.31 24.67,31.65 arc-45 26.44,32.38 43.08,32.38 arc-45 43.79,32.09 v44.13,31.75 | U1.7 84.22,26.99 arc45 82.45,26.25 arc-45 81.15,25.72 70.25,25.72 arc-45 68.48,26.45 arc-45 67.94,27.75 v67.94,33.02
  Bottom 0.4: v44.13,31.75 45.09,30.8 49.53,30.8 50.8,32.07 IC2.22 64.13,32.07 65.09,33.02 v67.94,33.02
  Bottom 1: MREQ.P$1 IC1.19
N$1
  Bottom 1: M1.P$1 IC1.27
N$2
  Top 0.4: R12.1 11.75,15.24 arc-29 15.24,14.13 arc89 IC4.6
N$3
  Bottom 0.4: R13.1 14.61,10.79 14.61,7.3 15.88,6.03 20.64,6.03 20.95,6.35 20.95,9.21 21.59,9.84 24.45,9.84 27.3,12.7 IC4.3 arc-90 IC4.3
N$4
  Bottom 0.4: U1.15 90.66,47.31 91.95,48.59 91.95,60.66 90.36,62.25 85.75,62.25 84.64,63.36 84.64,83.63 FTDI.5
N$5
  Top 0.4: LED_HALT.A 9.53,18.58 arc-20 R12.2
N$6
  Top 0.4: LED_DMA.A 10.32,11.12 arc-45 R13.2
N$7
  Top 0.4: L_DO.A 9.84,33.18 arc-70 6.35,30.08 arc50 R14.1
N$8
  Top 0.4: LED_IORQ.A arc45 9.83,26.03 arc0 9.53,25.73 arc-34 R15.1
N$9  (via drill 1 pad 1.78)
  other vias: 10.79,87.31
N$10
  Bottom 1: IC1.28 RFSH.P$1
N$11
  Top 0.4: FTDI.4 70.98,94.17 arc39 72.25,93.06 arc57 78.29,93.69 arc-114 87.82,89.72 87.82,87.7 arc90 90.32,85.2 90.6,85.2 92.34,85.2 arc-90 93.53,84.01 93.53,51.29 93.53,48.15 arc-45 93.45,47.96 arc-63 90.75,44.94 U1.14
N$13  (via drill 1 pad 1.78)
  other vias: 13.34,87.31
N$14  (via drill 1 pad 1.78)
  other vias: 15.88,87.31
N$15
  Top 0.3: LED_USR.K 94.04,90.13 arc-55 95.09,88.09 95.09,86.77 arc61 96.07,84.1 96.49,84.05 R17.1
N$16
  Top 0.3: D9.C 91.55,86.92 arc11 91.59,87.39 91.59,89.13 arc28 91.37,90.02 LED_USR.A
N$17
  Top 0.4: IC4.8 17.31,7.07 arc60 18.5,6.19 arc22 26.28,6.35 arc78 IC4.12
  Bottom 0.4: R15.2 10.81,22.86 12.86,20.8 12.86,16.04 15.56,13.34 15.56,9.04 IC4.8
N$18
  Top 0.3: R16.1 80.04,96.6 82.14,96.6 82.31,96.78 SW-USR.4
N$19  (via drill 1 pad 1.78)
  other vias: 18.41,87.31
N$20  (via drill 1 pad 1.78)
  other vias: 10.79,84.77
N$21  (via drill 1 pad 1.78)
  other vias: 13.34,84.77
N$22  (via drill 1 pad 1.78)
  other vias: 15.88,84.77
N$23  (via drill 1 pad 1.78)
  other vias: 18.41,84.77
N$24  (via drill 1 pad 1.78)
  other vias: 20.95,87.31
N$25  (via drill 1 pad 1.78)
  other vias: 23.49,87.31
N$26  (via drill 1 pad 1.78)
  other vias: 26.04,87.31
N$27  (via drill 1 pad 1.78)
  other vias: 28.57,87.31
N$28  (via drill 1 pad 1.78)
  other vias: 20.95,84.77
N$29  (via drill 1 pad 1.78)
  other vias: 23.49,84.77
N$30  (via drill 1 pad 1.78)
  other vias: 26.04,84.77
N$31  (via drill 1 pad 1.78)
  other vias: 28.57,84.77
N$32  (via drill 1 pad 1.78)
  other vias: 31.11,87.31
N$33  (via drill 1 pad 1.78)
  other vias: 33.66,87.31
N$34  (via drill 1 pad 1.78)
  other vias: 36.2,87.31
N$35  (via drill 1 pad 1.78)
  other vias: 38.73,87.31
N$36  (via drill 1 pad 1.78)
  other vias: 31.11,84.77
N$37  (via drill 1 pad 1.78)
  other vias: 33.66,84.77
N$38  (via drill 1 pad 1.78)
  other vias: 36.2,84.77
N$39  (via drill 1 pad 1.78)
  other vias: 38.73,84.77
N$40  (via drill 1 pad 1.78)
  other vias: 41.27,87.31
N$41  (via drill 1 pad 1.78)
  other vias: 43.82,87.31
N$43  (via drill 1 pad 1.78)
  other vias: 48.9,87.31
N$44  (via drill 1 pad 1.78)
  other vias: 41.27,84.77
N$45  (via drill 1 pad 1.78)
  other vias: 43.82,84.77
N$47  (via drill 1 pad 1.78)
  other vias: 48.9,84.77
N$48  (via drill 1 pad 1.78)
  other vias: 56.52,77.15
N$49  (via drill 1 pad 1.78)
  other vias: 59.05,77.15
N$50  (via drill 1 pad 1.78)
  other vias: 61.59,77.15
N$51  (via drill 1 pad 1.78)
  other vias: 64.13,77.15
N$52  (via drill 1 pad 1.78)
  other vias: 56.52,74.61
N$53  (via drill 1 pad 1.78)
  other vias: 59.05,74.61
N$54  (via drill 1 pad 1.78)
  other vias: 61.59,74.61
N$55  (via drill 1 pad 1.78)
  other vias: 64.13,74.61
N$56  (via drill 1 pad 1.78)
  other vias: 66.67,77.15
N$57  (via drill 1 pad 1.78)
  other vias: 69.21,77.15
N$58  (via drill 1 pad 1.78)
  other vias: 71.75,77.15
N$59  (via drill 1 pad 1.78)
  other vias: 74.3,77.15
N$60  (via drill 1 pad 1.78)
  other vias: 66.67,74.61
N$61  (via drill 1 pad 1.78)
  other vias: 69.21,74.61
N$62  (via drill 1 pad 1.78)
  other vias: 71.75,74.61
N$63  (via drill 1 pad 1.78)
  other vias: 74.3,74.61
N$64  (via drill 1 pad 1.78)
  other vias: 51.44,69.53
N$65  (via drill 1 pad 1.78)
  other vias: 51.44,72.07
N$66  (via drill 1 pad 1.78)
  other vias: 51.44,74.61
N$67  (via drill 1 pad 1.78)
  other vias: 51.44,77.15
N$68  (via drill 1 pad 1.78)
  other vias: 53.98,69.53
N$69  (via drill 1 pad 1.78)
  other vias: 53.98,72.07
N$70  (via drill 1 pad 1.78)
  other vias: 53.98,74.61
N$71  (via drill 1 pad 1.78)
  other vias: 53.98,77.15
N$72  (via drill 1 pad 1.78)
  other vias: 51.44,79.69
N$73  (via drill 1 pad 1.78)
  other vias: 51.44,82.23
N$74  (via drill 1 pad 1.78)
  other vias: 51.44,84.77
N$75  (via drill 1 pad 1.78)
  other vias: 51.44,87.31
N$76  (via drill 1 pad 1.78)
  other vias: 53.98,79.69
N$77  (via drill 1 pad 1.78)
  other vias: 53.98,82.23
N$78  (via drill 1 pad 1.78)
  other vias: 53.98,84.77
N$79  (via drill 1 pad 1.78)
  other vias: 53.98,87.31
N$80  (via drill 1 pad 1.78)
  other vias: 76.83,72.11
N$81  (via drill 1 pad 1.78)
  other vias: 79.38,72.11
N$82  (via drill 1 pad 1.78)
  other vias: 76.83,74.65
N$83  (via drill 1 pad 1.78)
  other vias: 76.83,77.19
N$84  (via drill 1 pad 1.78)
  other vias: 76.83,79.73
N$85  (via drill 1 pad 1.78)
  other vias: 76.83,82.27
N$86  (via drill 1 pad 1.78)
  other vias: 79.38,74.65
N$87  (via drill 1 pad 1.78)
  other vias: 48.9,72.07
N$92  (via drill 1 pad 1.78)
  other vias: 48.9,74.61
N$93  (via drill 1 pad 1.78)
  other vias: 48.9,77.15
N$94  (via drill 1 pad 1.78)
  other vias: 48.9,79.69
N$95  (via drill 1 pad 1.78)
  other vias: 48.9,82.23
N$96  (via drill 1 pad 1.78)
  other vias: 79.38,77.19
N$97  (via drill 1 pad 1.78)
  other vias: 79.38,79.73
N$98  (via drill 1 pad 1.78)
  other vias: 79.38,82.27
N$99  (via drill 1 pad 1.78)
  other vias: 8.26,79.69
N$100  (via drill 1 pad 1.78)
  other vias: 8.26,82.23
N$101  (via drill 1 pad 1.78)
  other vias: 8.26,84.77
N$102  (via drill 1 pad 1.78)
  other vias: 8.26,87.31
N$103  (via drill 1 pad 1.78)
  other vias: 8.26,89.85
N$104  (via drill 1 pad 1.78)
  other vias: 5.71,77.15
N$105  (via drill 1 pad 1.78)
  other vias: 5.71,79.69
N$106  (via drill 1 pad 1.78)
  other vias: 5.71,82.23
N$107  (via drill 1 pad 1.78)
  other vias: 5.71,84.77
N$108  (via drill 1 pad 1.78)
  other vias: 5.71,87.31
N$109  (via drill 1 pad 1.78)
  other vias: 8.26,77.15
N$110
  Top 0.4: U1.13 XIN.P$1
N$111
  Top 0.4: 90.18,39.7 XOUT.P$1
  Top 0.8: 90.18,39.7 arc90 U1.12
NMI
  Bottom 0.3: R8.1 10.92,36.05 10.92,33.63 15.99,28.56 NMI.P$1
  Bottom 1: NMI.P$1 IC1.17
PBROW0B1  (via drill 1 pad 1.78)
  Top 0.6: v56.44,72.07 v56.44,69.53 v56.44,66.99 v56.44,64.45
  Bottom 1: v56.44,72.07 v56.44,69.53 v56.44,66.99 v56.44,64.45
PBROW0B2  (via drill 1 pad 1.78)
  Top 0.6: v10.72,82.23 v10.72,79.69 v10.72,77.15
  Bottom 1: v10.72,82.23 v10.72,79.69 v10.72,77.15
PBROW0T1  (via drill 1 pad 1.78)
  Top 0.6: v56.44,79.69 v56.44,82.23 v56.44,84.77 v56.44,87.31
  Bottom 1: v56.44,79.69 v56.44,82.23 v56.44,84.77 v56.44,87.31
PBROW0T2  (via drill 1 pad 1.78)
  Top 0.6: v10.72,89.85 v10.72,92.39 v10.72,94.93
  Bottom 1: v10.72,89.85 v10.72,92.39 v10.72,94.93
PBROW1B1  (via drill 1 pad 1.78)
  Top 0.6: v58.98,72.07 v58.98,69.53 v58.98,66.99 v58.98,64.45
  Bottom 1: v58.98,72.07 v58.98,69.53 v58.98,66.99 v58.98,64.45
PBROW1B2  (via drill 1 pad 1.78)
  Top 0.6: v13.26,82.23 v13.26,79.69 v13.26,77.15
  Bottom 1: v13.26,82.23 v13.26,79.69 v13.26,77.15
PBROW1T1  (via drill 1 pad 1.78)
  Top 0.6: v58.98,79.69 v58.98,82.23 v58.98,84.77 v58.98,87.31
  Bottom 1: v58.98,79.69 v58.98,82.23 v58.98,84.77 v58.98,87.31
PBROW1T2  (via drill 1 pad 1.78)
  Top 0.6: v13.26,89.85 v13.26,92.39 v13.26,94.93
  Bottom 1: v13.26,89.85 v13.26,92.39 v13.26,94.93
PBROW2B1  (via drill 1 pad 1.78)
  Top 0.6: v61.52,72.07 v61.52,69.53 v61.52,66.99 v61.52,64.45
  Bottom 1: v61.52,72.07 v61.52,69.53 v61.52,66.99 v61.52,64.45
PBROW2B2  (via drill 1 pad 1.78)
  Top 0.6: v15.8,82.23 v15.8,79.69 v15.8,77.15
  Bottom 1: v15.8,82.23 v15.8,79.69 v15.8,77.15
PBROW2T1  (via drill 1 pad 1.78)
  Top 0.6: v61.52,79.69 v61.52,82.23 v61.52,84.77 v61.52,87.31
  Bottom 1: v61.52,79.69 v61.52,82.23 v61.52,84.77 v61.52,87.31
PBROW2T2  (via drill 1 pad 1.78)
  Top 0.6: v15.8,89.85 v15.8,92.39 v15.8,94.93
  Bottom 1: v15.8,89.85 v15.8,92.39 v15.8,94.93
PBROW3B1  (via drill 1 pad 1.78)
  Top 0.6: v64.06,72.07 v64.06,69.53 v64.06,66.99 v64.06,64.45
  Bottom 1: v64.06,72.07 v64.06,69.53 v64.06,66.99 v64.06,64.45
PBROW3B2  (via drill 1 pad 1.78)
  Top 0.6: v18.34,82.23 v18.34,79.69 v18.34,77.15
  Bottom 1: v18.34,82.23 v18.34,79.69 v18.34,77.15
PBROW3T1  (via drill 1 pad 1.78)
  Top 0.6: v64.06,79.69 v64.06,82.23 v64.06,84.77 v64.06,87.31
  Bottom 1: v64.06,79.69 v64.06,82.23 v64.06,84.77 v64.06,87.31
PBROW3T2  (via drill 1 pad 1.78)
  Top 0.6: v18.34,89.85 v18.34,92.39 v18.34,94.93
  Bottom 1: v18.34,89.85 v18.34,92.39 v18.34,94.93
PBROW4B1  (via drill 1 pad 1.78)
  Top 0.6: v66.6,72.07 v66.6,69.53 v66.6,66.99 v66.6,64.45
  Bottom 1: v66.6,72.07 v66.6,69.53 v66.6,66.99 v66.6,64.45
PBROW4B2  (via drill 1 pad 1.78)
  Top 0.6: v20.88,82.23 v20.88,79.69 v20.88,77.15
  Bottom 1: v20.88,82.23 v20.88,79.69 v20.88,77.15
PBROW4T1  (via drill 1 pad 1.78)
  Top 0.6: v66.6,79.69 v66.6,82.23 v66.6,84.77 v66.6,87.31
  Bottom 1: v66.6,79.69 v66.6,82.23 v66.6,84.77 v66.6,87.31
PBROW4T2  (via drill 1 pad 1.78)
  Top 0.6: v20.88,89.85 v20.88,92.39 v20.88,94.93
  Bottom 1: v20.88,89.85 v20.88,92.39 v20.88,94.93
PBROW5B1  (via drill 1 pad 1.78)
  Top 0.6: v69.14,72.07 v69.14,69.53 v69.14,66.99 v69.14,64.45
  Bottom 1: v69.14,72.07 v69.14,69.53 v69.14,66.99 v69.14,64.45
PBROW5B2  (via drill 1 pad 1.78)
  Top 0.6: v23.42,82.23 v23.42,79.69 v23.42,77.15
  Bottom 1: v23.42,82.23 v23.42,79.69 v23.42,77.15
PBROW5T1  (via drill 1 pad 1.78)
  Top 0.6: v69.14,79.69 v69.14,82.23 v69.14,84.77 v69.14,87.31
  Bottom 1: v69.14,79.69 v69.14,82.23 v69.14,84.77 v69.14,87.31
PBROW5T2  (via drill 1 pad 1.78)
  Top 0.6: v23.42,89.85 v23.42,92.39 v23.42,94.93
  Bottom 1: v23.42,89.85 v23.42,92.39 v23.42,94.93
PBROW6B1  (via drill 1 pad 1.78)
  Top 0.6: v71.68,72.07 v71.68,69.53 v71.68,66.99 v71.68,64.45
  Bottom 1: v71.68,72.07 v71.68,69.53 v71.68,66.99 v71.68,64.45
PBROW6B2  (via drill 1 pad 1.78)
  Top 0.6: v25.96,82.23 v25.96,79.69 v25.96,77.15
  Bottom 1: v25.96,82.23 v25.96,79.69 v25.96,77.15
PBROW6T1  (via drill 1 pad 1.78)
  Top 0.6: v71.68,79.69 v71.68,82.23 v71.68,84.77 v71.68,87.31
  Bottom 1: v71.68,79.69 v71.68,82.23 v71.68,84.77 v71.68,87.31
PBROW6T2  (via drill 1 pad 1.78)
  Top 0.6: v25.96,89.85 v25.96,92.39 v25.96,94.93
  Bottom 1: v25.96,89.85 v25.96,92.39 v25.96,94.93
PBROW7B1  (via drill 1 pad 1.78)
  Top 0.6: v74.22,72.07 v74.22,69.53 v74.22,66.99 v74.22,64.45
  Bottom 1: v74.22,72.07 v74.22,69.53 v74.22,66.99 v74.22,64.45
PBROW7B2  (via drill 1 pad 1.78)
  Top 0.6: v28.5,82.23 v28.5,79.69 v28.5,77.15
  Bottom 1: v28.5,82.23 v28.5,79.69 v28.5,77.15
PBROW7T1  (via drill 1 pad 1.78)
  Top 0.6: v74.22,79.69 v74.22,82.23 v74.22,84.77 v74.22,87.31
  Bottom 1: v74.22,79.69 v74.22,82.23 v74.22,84.77 v74.22,87.31
PBROW7T2  (via drill 1 pad 1.78)
  Top 0.6: v28.5,89.85 v28.5,92.39 v28.5,94.93
  Bottom 1: v28.5,89.85 v28.5,92.39 v28.5,94.93
PBROW8B1  (via drill 1 pad 1.78)
  Top 0.6: v31.04,82.23 v31.04,79.69 v31.04,77.15
  Bottom 1: v31.04,82.23 v31.04,79.69 v31.04,77.15
PBROW8T1  (via drill 1 pad 1.78)
  Top 0.6: v31.04,89.85 v31.04,92.39 v31.04,94.93
  Bottom 1: v31.04,89.85 v31.04,92.39 v31.04,94.93
PBROW9B1  (via drill 1 pad 1.78)
  Top 0.6: v33.58,82.23 v33.58,79.69 v33.58,77.15
  Bottom 1: v33.58,82.23 v33.58,79.69 v33.58,77.15
PBROW9T1  (via drill 1 pad 1.78)
  Top 0.6: v33.58,89.85 v33.58,92.39 v33.58,94.93
  Bottom 1: v33.58,89.85 v33.58,92.39 v33.58,94.93
PBROW10B1  (via drill 1 pad 1.78)
  Top 0.6: v36.12,82.23 v36.12,79.69 v36.12,77.15
  Bottom 1: v36.12,82.23 v36.12,79.69 v36.12,77.15
PBROW10T1  (via drill 1 pad 1.78)
  Top 0.6: v36.12,89.85 v36.12,92.39 v36.12,94.93
  Bottom 1: v36.12,89.85 v36.12,92.39 v36.12,94.93
PBROW11B1  (via drill 1 pad 1.78)
  Top 0.6: v38.66,82.23 v38.66,79.69 v38.66,77.15
  Bottom 1: v38.66,82.23 v38.66,79.69 v38.66,77.15
PBROW11T1  (via drill 1 pad 1.78)
  Top 0.6: v38.66,89.85 v38.66,92.39 v38.66,94.93
  Bottom 1: v38.66,89.85 v38.66,92.39 v38.66,94.93
PBROW12B1  (via drill 1 pad 1.78)
  Top 0.6: v41.2,82.23 v41.2,79.69 v41.2,77.15
  Bottom 1: v41.2,82.23 v41.2,79.69 v41.2,77.15
PBROW12T1  (via drill 1 pad 1.78)
  Top 0.6: v41.2,89.85 v41.2,92.39 v41.2,94.93
  Bottom 1: v41.2,89.85 v41.2,92.39 v41.2,94.93
PBROW13B1  (via drill 1 pad 1.78)
  Top 0.6: v43.74,82.23 v43.74,79.69 v43.74,77.15
  Bottom 1: v43.74,82.23 v43.74,79.69 v43.74,77.15
PBROW13T1  (via drill 1 pad 1.78)
  Top 0.6: v43.74,89.85 v43.74,92.39 v43.74,94.93
  Bottom 1: v43.74,89.85 v43.74,92.39 v43.74,94.93
PD5
  Top 0.3: 91.1,84.21 R17.2 | 80.04,91.35 R16.2
  Top 0.4: 89.14,82.25 88.3,81.41 arc45 87.56,79.64 87.56,69.15 arc45 87.82,68.25 arc-50 88.93,63.48 arc21 88.81,58.32 arc75 89.64,57.53 U1.19 | 91.1,84.21 89.14,82.25 | 89.14,82.25 80.04,91.35
RD  (via drill 0.6)
  Top 0.4: v63.82,15.56 64.04,15.78 arc45 64.77,17.55 v64.77,23.18 64.77,35.12 arc45 64.23,36.41 arc45 62.46,37.15 IC2.24
  Bottom 0.4: RD.P$1 36.51,20.64 49.93,20.64 55.01,15.56 v63.82,15.56 | v64.77,23.18 85.72,23.18 86.99,24.45 U1.6
  Bottom 1: RD.P$1 IC1.21
RESET  (via drill 0.6)
  Top 0.4: RESET.P$1 39.38,33.66 | v47.7,17.77 48.02,18.46 arc25 48.26,19.53 48.26,32.02 arc45 47.89,32.92 47.84,32.97 arc45 46.94,33.34 44.29,33.34 arc-23 42.07,33.58 arc13 39.45,33.66 39.38,33.66 | R19.1 39.38,34.85 39.38,33.66
  Bottom 0.4: U1.8 91.12,29.53 92.07,28.57 92.07,23.81 91.44,23.18 87.31,23.18 86.04,21.91 81.6,21.91 80.01,20.32 80.01,14.29 75.56,9.84 72.07,9.84 71.28,10.79 54.77,10.79 53.66,11.75 53.72,11.75 v47.7,17.77
  Bottom 1: IC1.26 RESET.P$1
RESUME
  Top 0.3: 36.37,6.83 83.34,6.83 arc45 85.11,7.56 88.75,11.2 arc-45 90.02,11.72 U1.1
  Top 0.4: 30.01,6.91 arc12 30.97,6.27 arc71 33.83,6.51 arc-46 36.37,6.83 | 30.01,6.91 29.84,7.15 | 30.01,6.91 29.85,7.15 arc-90 IC4.13
  Bottom 0.3: 14.83,27.3 18.79,27.3 28.59,17.5 28.59,9.62 29.81,8.4
  Bottom 0.4: R14.2 12.92,29.21 14.83,27.3 | 29.84,8.4 29.81,8.4 arc-90 29.85,8.36 IC4.13
RTS
  Bottom 0.4: C6.1 90.17,82.23 83.82,88.58 83.82,91.12 84.45,91.76 84.45,93.03 82.87,94.61 FTDI.6
SCL
  Top 0.4: U1.22 76.12,57.47 arc45 77.88,58.2 78.64,58.96 arc45 79.38,60.73 79.38,63.1 arc-45 80.11,64.87 R9.1 82.45,67.21 arc45 83.18,68.98 83.18,81.51 arc45 82.45,83.28 76.3,89.44 arc45 74.53,90.17 59.55,90.17 | SCL.P$1 51.44,94.54 arc45 52.17,91.98 53.24,90.9 arc45 55.01,90.17 59.55,90.17 | W1.P$1 59.55,90.2 59.55,90.17
SDA
  Top 0.4: U1.23 78.66,54.93 arc45 80.42,55.66 81.18,56.42 arc45 81.91,58.19 R11.1 83.41,65.62 arc45 84.14,67.39 84.14,82.15 arc45 83.41,83.92 76.61,90.71 arc45 74.85,91.44 61.46,91.44 | SDA.P$1 53.98,93.47 arc45 54.51,92.17 arc45 56.28,91.44 61.46,91.44 | W2.P$1 61.46,91.44
VCC  (via drill 0.6, 0.8, 1 pad 1.78)
  Top 0.4: IC2.30 64.45,52.39 | R18.2 16.2,17.79 arc61 10.32,16.52 3.65,10.32
  Top 0.8: 59.05,97.14 59.21,97.14
  Top 1: 64.45,52.09 64.45,52.39 C3.1 IC2.32 | 64.45,52.09 64.45,50.75 arc45 65.18,48.98 70.56,43.61 arc-45 71.29,41.84 71.29,37.27 C5.1 | 15.81,43.92 VCC.P$1 C1.1 R8.2 10.39,41.3 4.13,41.3 | U1.10 90.19,34.48 arc-45 91.09,34.1 92.99,32.2 C4.1 93.52,32.02 97.79,32.02 | 56.41,97.17 56.41,94.94 I2CV.P$1 | 1.91,41.3 3.81,41.3 4.13,41.3 | 97.79,63.18 arc45 98.41,64.69 98.41,83.73 arc56 97.3,85.81 96.51,86.34 96.51,86.41 D9.A | v84.03,37.1 74.96,37.1 U1.30 | 68.49,94.67 FTDI.3 | v32.25,4.01 32.27,2.66 | v32.23,2.94 32.23,3.02 | C13.+ 97.5,22.58 arc-90 97.79,22.87 | C14.+ 2.22,47.64 arc90 1.91,47.32 | C15.+ 64.45,52.09 | PWR2.1 41.61,5.35 41.61,2.54 | W3.P$1 4.13,41.3 | v46.36,89.85 v46.36,87.31 46.36,84.69 46.36,82.15 | v59.05,94.69 59.05,97.14
  Top 1.5: 56.37,97.16 57.96,97.16 57.96,97.14 | 56.37,97.16 10.05,97.16 arc45 9.15,96.78 8.95,96.58 arc46 8.58,95.67 8.6,93.81 arc-52 8.13,92.8 2.38,88.17 arc51 1.91,87.18 1.91,47.32 1.91,41.3 1.91,12.59 arc45 2.28,11.69 3.65,10.32 3.81,10.16 11.06,2.91 arc45 11.96,2.54 32.39,2.54 | 32.39,2.54 41.61,2.54 86.77,2.54 arc46 87.69,2.92 97.43,12.96 arc44 97.79,13.85 97.79,22.87 97.79,32.02 97.79,63.18 | 57.82,97.14 57.96,97.14 | 57.96,97.14 59.21,97.14 66.79,97.14 arc-41 67.62,96.83 68.05,96.45 arc-49 68.49,95.5 68.49,94.67 | 32.27,2.66 32.39,2.54 | 56.41,97.17 56.37,97.17 56.37,97.16
  Bottom 0.4: 61.49,52.5 50.63,52.5 48.35,54.77 46.44,54.77 IC2.2
  Bottom 0.6: IC2.2 48.26,54.93 48.26,56.83 48.26,58.42 46.67,60.01 A16.P$1
  Bottom 0.8: 32.25,7.32 32.39,7.32 IC4.14 | v46.36,82.23 v46.36,84.77 v46.36,87.31 46.36,88.66 v46.36,89.85 47.7,91.2 48.9,91.2 54.85,91.2 56.59,92.95 56.59,94.69 | 56.59,94.69 I2CV.P$1 | 56.59,94.69 59.13,94.69
  Bottom 1: VCC.P$1 IC1.11 19.68,43.81 24.76,38.73 25.8,38.73 | U1.30 74.79,37.08 71.46,37.08 C5.1 | 61.49,52.5 IC2.30 | 87.04,66.67 87.04,64.22 R11.2 | D9.A 96.49,86.25 96.33,86.36 93.34,84.48 93.34,80.85 91.59,79.1 D8.C 91.41,78.92 91.41,76.65 R10.2 91.41,76.47 87.04,72.1 87.04,66.67 | 87.04,66.67 R9.2 | 86.69,34.6 v84.03,37.1 82.6,37.1 v82.55,37.15 | 86.69,34.6 89.66,34.6 90.02,34.48 U1.10 | 25.8,38.73 v29.84,38.73 | v29.84,38.73 31.11,38.73 | IC2.32 C3.1 64.45,55.67 arc90 C8.1 | v32.23,2.94 32.27,3.69 v32.25,4.01 32.25,7.32 | C11.1 arc-90 45.29,12.46 38.18,12.46 C2.1 35.41,9.45 34.19,8.22 33.43,7.46 IC4.14 | 15.8,43.89 arc-90 VCC.P$1 | C1.1 VCC.P$1 | VCC.P$1 13.44,43.81 arc-90 C9.1 | C10.1 25.8,38.73 | C7.1 v29.84,38.73 | C12.1 86.52,34.43 arc90 86.69,34.6
WAIT  (via drill 0.6)
  Top 0.3: 81.03,9.23 41.28,9.23 arc-51 39.41,10.11 arc51 37.48,11.03 26.04,11.03
  Top 0.4: v25.4,28.57 arc45 25.08,27.81 25.08,27.71 arc51 25.41,19.37 arc-36 26.04,17.47 26.04,11.03 26.04,8.81 arc-108 IC4.11 IC4.10 | 81.03,9.23 86.62,14.82 arc-45 88.39,15.56 89.69,15.56 arc63 92.07,16.51 arc101 90.73,19.37 U1.4
  Bottom 0.4: IC1.24 v25.4,28.57
  Bottom 1: IC1.24 WAIT.P$1
WR
  Top 0.4: IC2.29 65.62,45.82 arc-45 66.36,44.05 66.36,23.18 | 66.36,23.18 66.36,15.96 arc-45 66.1,14.98 arc-45 64.62,13.97 49.61,13.97 arc-45 47.84,14.7 39.79,22.76 arc45 38.02,23.5 WR.P$1 | U1.5 89.63,22.45 arc45 87.86,23.18 66.36,23.18
  Bottom 1: IC1.22 WR.P$1

### Text on the board
Top: TOP
Bottom: BOTTOM | PCB by WestfW
History: 20170512 by WestfW: Put some power and Gnd vias near the prototype area! | 20170228 by WestfW: "version 2" in silkscreen | 20170204 by WestfW: Change "RTS" label on FTDI conn to "DTR" | 20170203 by WestfW: Commit to RCS, Github. "Publish!" | 20170202 by WestfW: replace PWR1 connector with 2.54mm spaced pins, address some ERC warnings | 20170125 by WestfW: replace 7400 with more compact schematic symbol version. | 20170125 by WestfW: DAMNIT 2! Swap Rx/Tx pins. Duh. | 20170120 by WestfW: Add Values in SCH. Divide into multiple sheets. | 20170120 by WestfW: Add missing pullup (IORQ) and pulldown (RESET) | 20170116 by WestfW: Increase Bottom RestRing. Move new SDA pad. | 20170116 by WestfW: DAMNIT! new SCL pad is on top of GND trace :-( SHORT! | 20170116 by WestfW: PCB arrives! | 20170111 by WestfW: 8pm - Sent Gebers to PCBWAY | 20170111 by WestfW: Enlarge and reposition i2C connector. Add extra I2C pads. | 20170109 by WestfW: Power cons, redo Z80 to leave vias uncovered | 20170109 by WestfW: more bypass caps. Beef up some power connections | 20170109 by WestfW: add top "Styling." Adjust proto area. Bottom silk. | 20170109 by WestfW: "Robustify" auto-router routes. Finished routing? | 20170108 by WestfW: Initial version based on / https://hackaday.io/project/19000-a-4-4ics-z80-homemade-computer-on-breadboard
To-Do: To do: | !! THIS BOARD HAS NOT BEEN FABBED OR TESTED !! | (However, it should have only "bug fixes" since the last tested version) | R16 and R17 have the values swapped
_tSilk: Version 2 | I2C | FTDI | 6 | GND | SCL | SDA | VCC | 1 | VCC | TX | RX | DTR | SDA | SCL | USER | D9 | C6 | D8 | 10k | IC1 Z80 | 10k | A11 | 1 | A10 | 10k | A12 | CMOS Z80 / Z84C0004 | A9 | 4.7k | 10k | A13 | A8 | 4.7k | RESET | 10k | A14 | A7 | A16 | CLK | 10k | A15 | A6 | IC2 MEM | C3 | 10k | CLK | 1 | A5 | 64k*8 or 128k*8 / JEDEC Static RAM | TC551001-70 | D4 | A4 | D3 | A3 | + | D5 | PORTD | A2 | D6 | A1 | + | C1 | VCC | + | A0 | D2 | GND | PORTC | D7 | 10k | PWR | D0 | 10k | C5 | - | D0 | D1 | C4 | RESET | INT | BUSREQ | NMI | WAIT | IORQ | HALT | BUSAK | MREQ | WR | IORQ | HLT | RD | + | 10k | ATmega32a | 74HC00 | DMA | PORTA | 1 | PORTB | C2 | * | IC4 I/O | IC3 | + | - | PWR | SPFD
_bplace: A10 | 1 | IC1 Z80 | A15 | CLK | 1 | IC2 MEM | A16/Vcc | WR | PORTD | A0 | PORTC | RD | D1 | RESET | INT | BUSREQ | MREQ | D7 | WAIT | D0 | HALT | BUSAK | D6 | D1 | MREQ | D5 | WR | D2 | IORQ | D4 | RD | D3 | PORTB | PORTA | IC4 I/O | 1 | https://hackaday.io/project/19000 / Z80 4-chip computer / By "Just4Fun" PCB by "WestfW"